# EAGLE design SKAARDUINO_v4.1 (EAGLE 7.5.0)

## Sheet 1 of 2
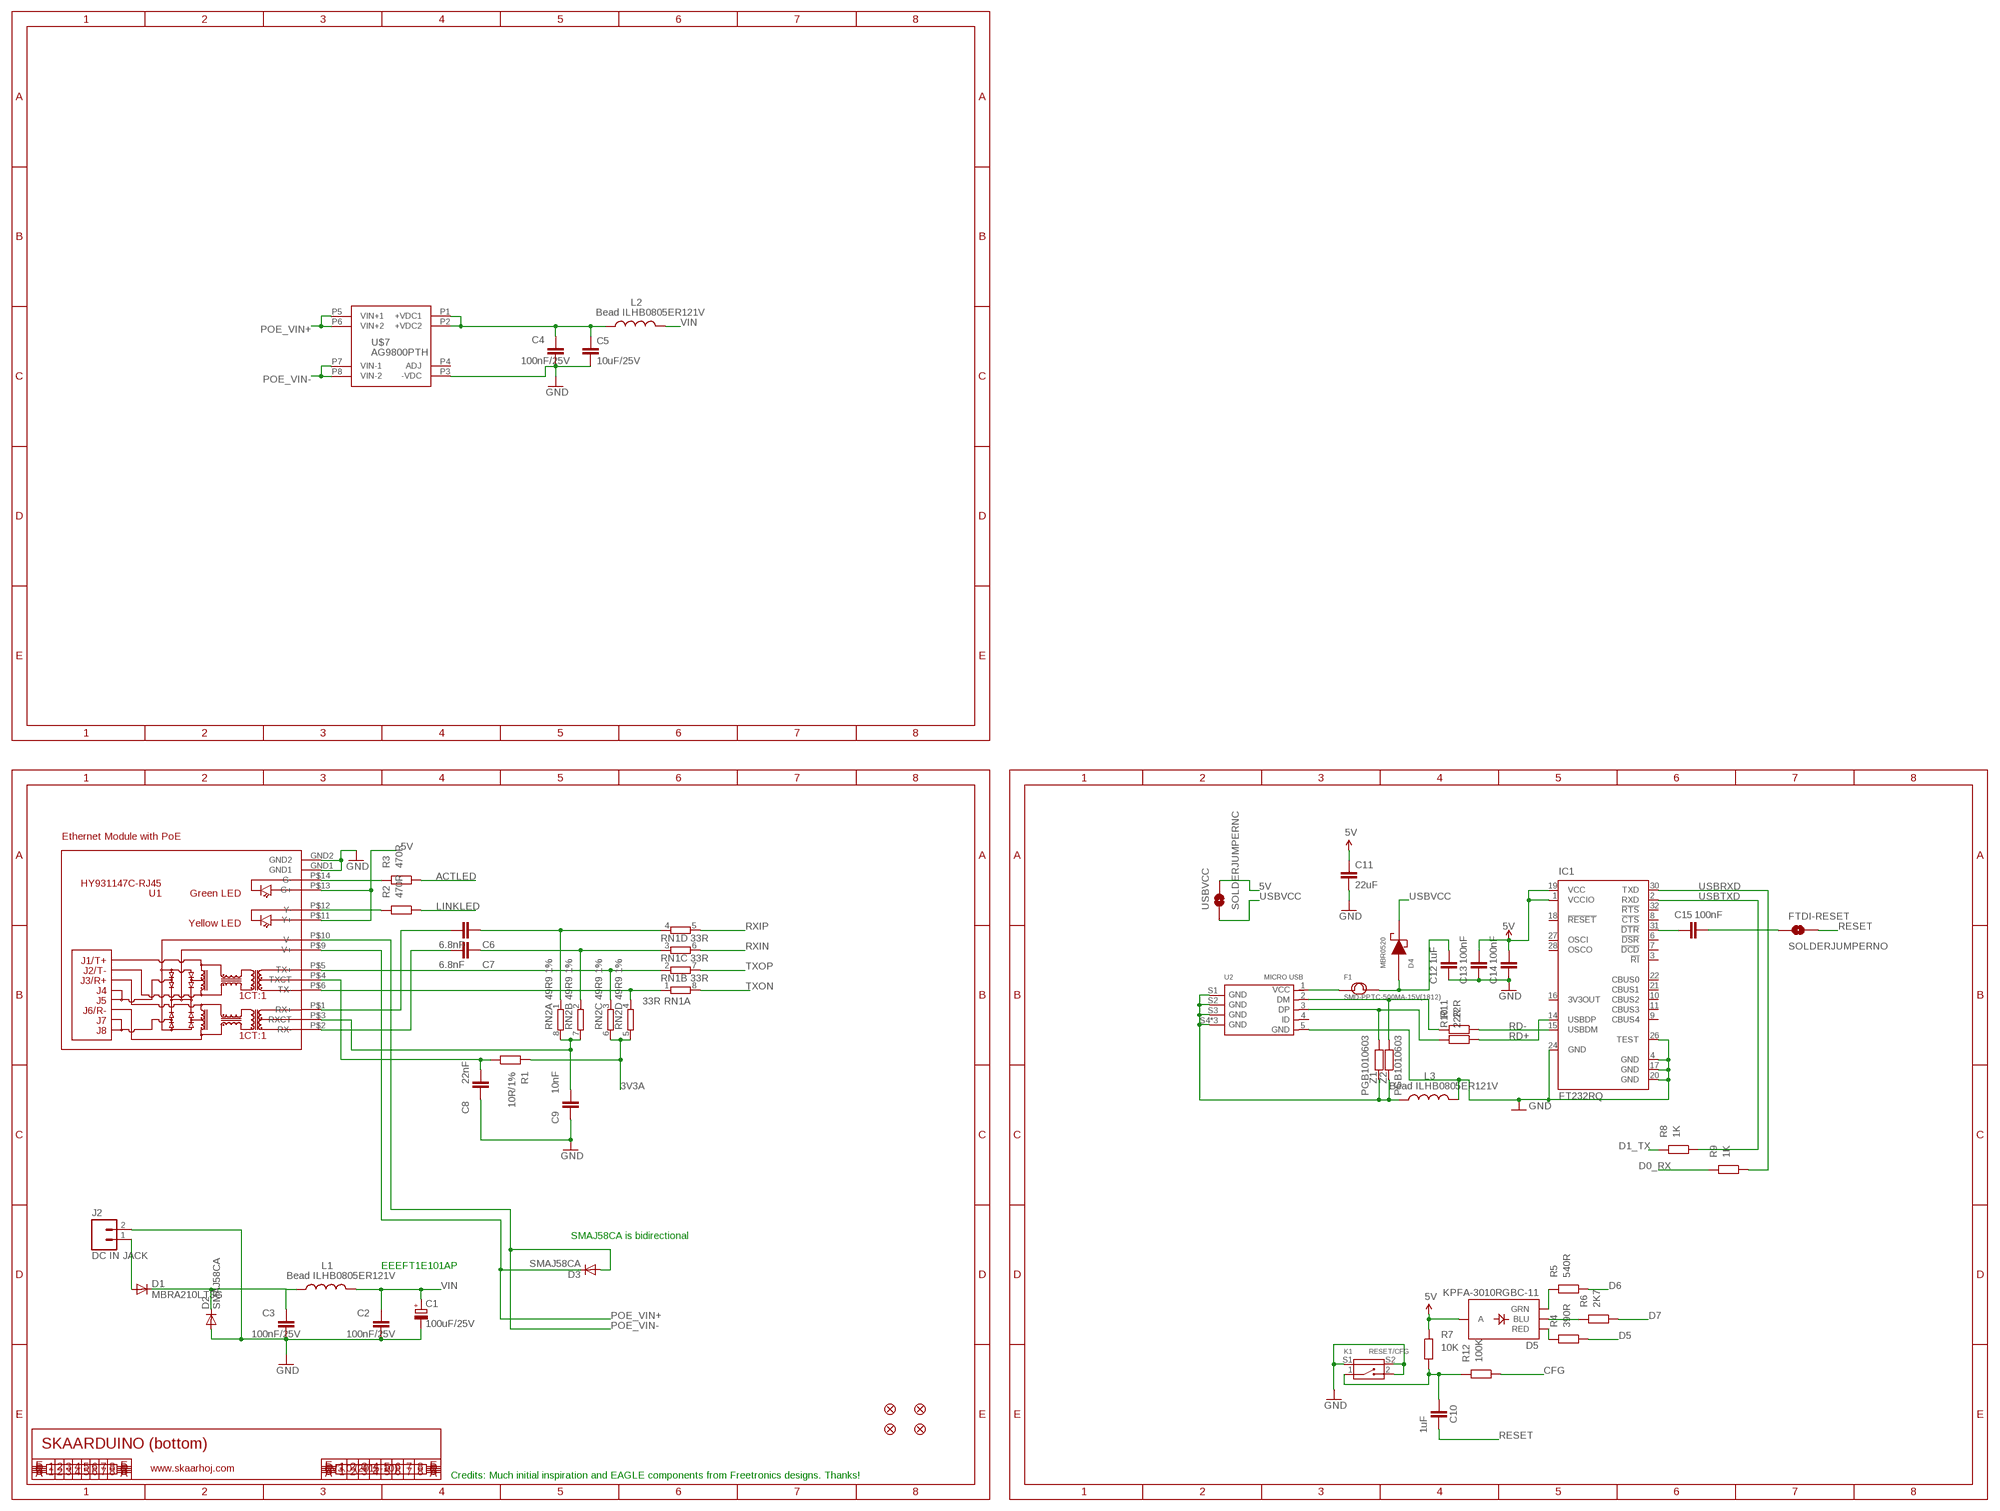
[diagram p0: schematic, sheet 1]

### Parts
C1  100uF/25V  CPOL-EUD  [PANASONIC_D]
C2  100nF/25V  CAP0402  [C0402]
C3  100nF/25V  CAP0402  [C0402]
C4  100nF/25V  CAP0402  [C0402]
C5  10uF/25V  CAP0805  [0805]
C6  6.8nF  C-EU0402C  [0402C]
C7  6.8nF  C-EU0402C  [0402C]
C8  22nF  C-EU0402C  [0402C]
C9  10nF  C-EU0402C  [0402C]
C10  1uF  C-EU0402C  [0402C]
C11  22uF  CAP0805  [0805]
C12  1uF  C-EU0402C  [0402C]
C13  100nF  C-EU0402C  [0402C]
C14  100nF  C-EU0402C  [0402C]
C15  100nF  C-EU0402C  [0402C]
D1  MBRA210LT3G  DIODESMA  [SMA-DIODE]
D2  SMAJ58CA  DIODESMA  [SMA-DIODE]
D3  SMAJ58CA  DIODESMA  [SMA-DIODE]
D4  MBR0520  [SOD-123]
D5  KPFA-3010RGBC-11  LED-TRICOLOR  [LED-TRICOLOR-SMD]
F1  SMD-PPTC-500MA-15V(1812)  [F1812]
FID1  FIDUCIAL1X2.5  [FIDUCIAL-1X2.5]
FID2  FIDUCIAL1X2.5  [FIDUCIAL-1X2.5]
FID3  FIDUCIAL1X2.5  [FIDUCIAL-1X2.5]
FID4  FIDUCIAL1X2.5  [FIDUCIAL-1X2.5]
FTDI-RESET  SOLDERJUMPERNO  [SJ_2S-NO]
IC1  FT232RQ  [QFN32]
J2  DC IN JACK  M02PTH  [1X02]
K1  RESET/CFG  SMD-BUTTON-2+2P  [SW4-SMD-7.0X3.5X3.5MM-90D]
L1  Bead ILHB0805ER121V  L-USL2012C  [L2012C]
L2  Bead ILHB0805ER121V  L-USL2012C  [L2012C]
L3  Bead ILHB0805ER121V  L-USL2012C  [L2012C]
R1  10R/1%  RESISTOR0402  [0402]
R2  470R  RESISTOR0402  [0402]
R3  470R  RESISTOR0402  [0402]
R4  390R  RESISTOR0402  [0402]
R5  540R  RESISTOR0402  [0402]
R6  2K7  RESISTOR0402  [0402]
R7  10K  RESISTOR0402  [0402]
R8  1K  RESISTOR0402  [0402]
R9  1K  RESISTOR0402  [0402]
R10  22R  RESISTOR0402  [0402]
R11  22R  RESISTOR0402  [0402]
R12  100K  RESISTOR0402  [0402]
RN1  33R  4R-NCAY16  [CAY16]
RN2  49R9 1%  4R-NCAY16  [CAY16]
U1  HY931147C-RJ45  [HY931147C]
U2  MICRO USB  MICRO-USB-SMD-B-WITHOUT-POST-W/P(ST-USB-001G)  [MICRO-USB5+4P-SMD-0.65-B]
U$7  AG9800PTH  [AG9800PTH]
USBVCC  SOLDERJUMPERNC  [SJ_2S]
Z1  PGB1010603  RESISTOR0402  [C0402]
Z2  PGB1010603  RESISTOR0402  [C0402]

### Nets
3V3A: R1.2 RN2.5 RN2.6 ; also sheet 2
5V [power]: C11.1 C13.2 C14.2 D5.A IC1.1(VCCIO) IC1.19(VCC) R7.2 U1.P$11(Y+) U1.P$13(G+) USBVCC.2 ; also sheet 2
ACTLED: R3.1 ; also sheet 2
CFG: R12.1 ; also sheet 2
CFGSW: C10.2 K1.1 R7.1 R12.2
D0_RX: R9.2 ; also sheet 2
D1_TX: R8.2 ; also sheet 2
D5: R4.1 ; also sheet 2
D6: R5.1 ; also sheet 2
D7: R6.1 ; also sheet 2
GND [power]: C1.- C2.2 C3.2 C4.2 C5.2 C8.1 C9.1 C11.2 C12.1 C13.1 C14.1 D2.A IC1.4(GND) IC1.17(GND) IC1.20(GND) IC1.24(GND) IC1.26(TEST) J2.2 K1.2 K1.S1 K1.S2 L3.2 U1.GND1 U1.GND2 U2.5(GND) U$7.P3(-VDC) ; also sheet 2
LINKLED: R2.1 ; also sheet 2
N$1: C8.2 R1.1 U1.P$4(TXCT)
N$2: C15.2 FTDI-RESET.1
N$3: D5.B(BLU) R6.2
N$4 [VIN]: C3.1 D1.C D2.C L1.1
N$5: D5.G(GRN) R5.2
N$6 [VIN]: C12.2 D4.2(AN) F1.2
N$7 [VIN]: F1.1 U2.1(VCC)
N$9: C7.2 U1.P$2(RX-)
N$11: C6.2 U1.P$1(RX+)
N$13 [VIN]: D1.A J2.1
N$15: D5.R(RED) R4.2
N$16: R10.2 U2.3(DP) Z1.1
N$17: R11.2 U2.2(DM) Z2.1
N$18: C15.1 IC1.31(!DTR)
N$21: L3.1 U2.S1(GND) U2.S2(GND) U2.S3(GND) U2.S4(GND) U2.S5(GND) U2.S6(GND) Z1.2 Z2.2
N$67: R3.2 U1.P$14(G-)
N$321: C9.2 RN2.7 RN2.8 U1.P$3(RXCT)
N$332: R2.2 U1.P$12(Y-)
POE_DC_RETURN [VIN]: C4.1 C5.1 L2.1 U$7.P1(+VDC1) U$7.P2(+VDC2)
POE_VIN+ [VIN]: D3.C U1.P$9(V+) U$7.P5(VIN+1) U$7.P6(VIN+2)
POE_VIN- [VIN]: D3.A U1.P$10(V-) U$7.P7(VIN-1) U$7.P8(VIN-2)
RD+: IC1.14(USBDP) R10.1
RD-: IC1.15(USBDM) R11.1
RESET: C10.1 FTDI-RESET.2 ; also sheet 2
RXIN: RN1.6 ; also sheet 2
RXIN_E: C7.1 RN1.3 RN2.2
RXIP: RN1.5 ; also sheet 2
RXIP_E: C6.1 RN1.4 RN2.1
TXON: RN1.8 ; also sheet 2
TXON_E: RN1.1 RN2.4 U1.P$6(TX-)
TXOP: RN1.7 ; also sheet 2
TXOP_E: RN1.2 RN2.3 U1.P$5(TX+)
USBRXD: IC1.30(TXD) R9.1
USBTXD: IC1.2(RXD) R8.1
USBVCC [VIN]: D4.1(CA) USBVCC.1
VIN [VIN]: C1.+ C2.1 L1.2 L2.2 ; also sheet 2
Unconnected: IC1.3(!RI) IC1.6(!DSR) IC1.7(!DCD) IC1.8(!CTS) IC1.9(CBUS4) IC1.10(CBUS2) IC1.11(CBUS3) IC1.16(3V3OUT) IC1.18(!RESET) IC1.21(CBUS1) IC1.22(CBUS0) IC1.27(OSCI) IC1.28(OSCO) IC1.32(!RTS) U2.4(ID) U$7.P4(ADJ)

### Notes on the sheet
- Ethernet Module with PoE
- SMAJ58CA is bidirectional
- EEEFT1E101AP
- SKAARDUINO (bottom)
- www.skaarhoj.com | V3.0 (2015-10)
- Credits: Much initial inspiration and EAGLE components from Freetronics designs. Thanks!

## Sheet 2 of 2
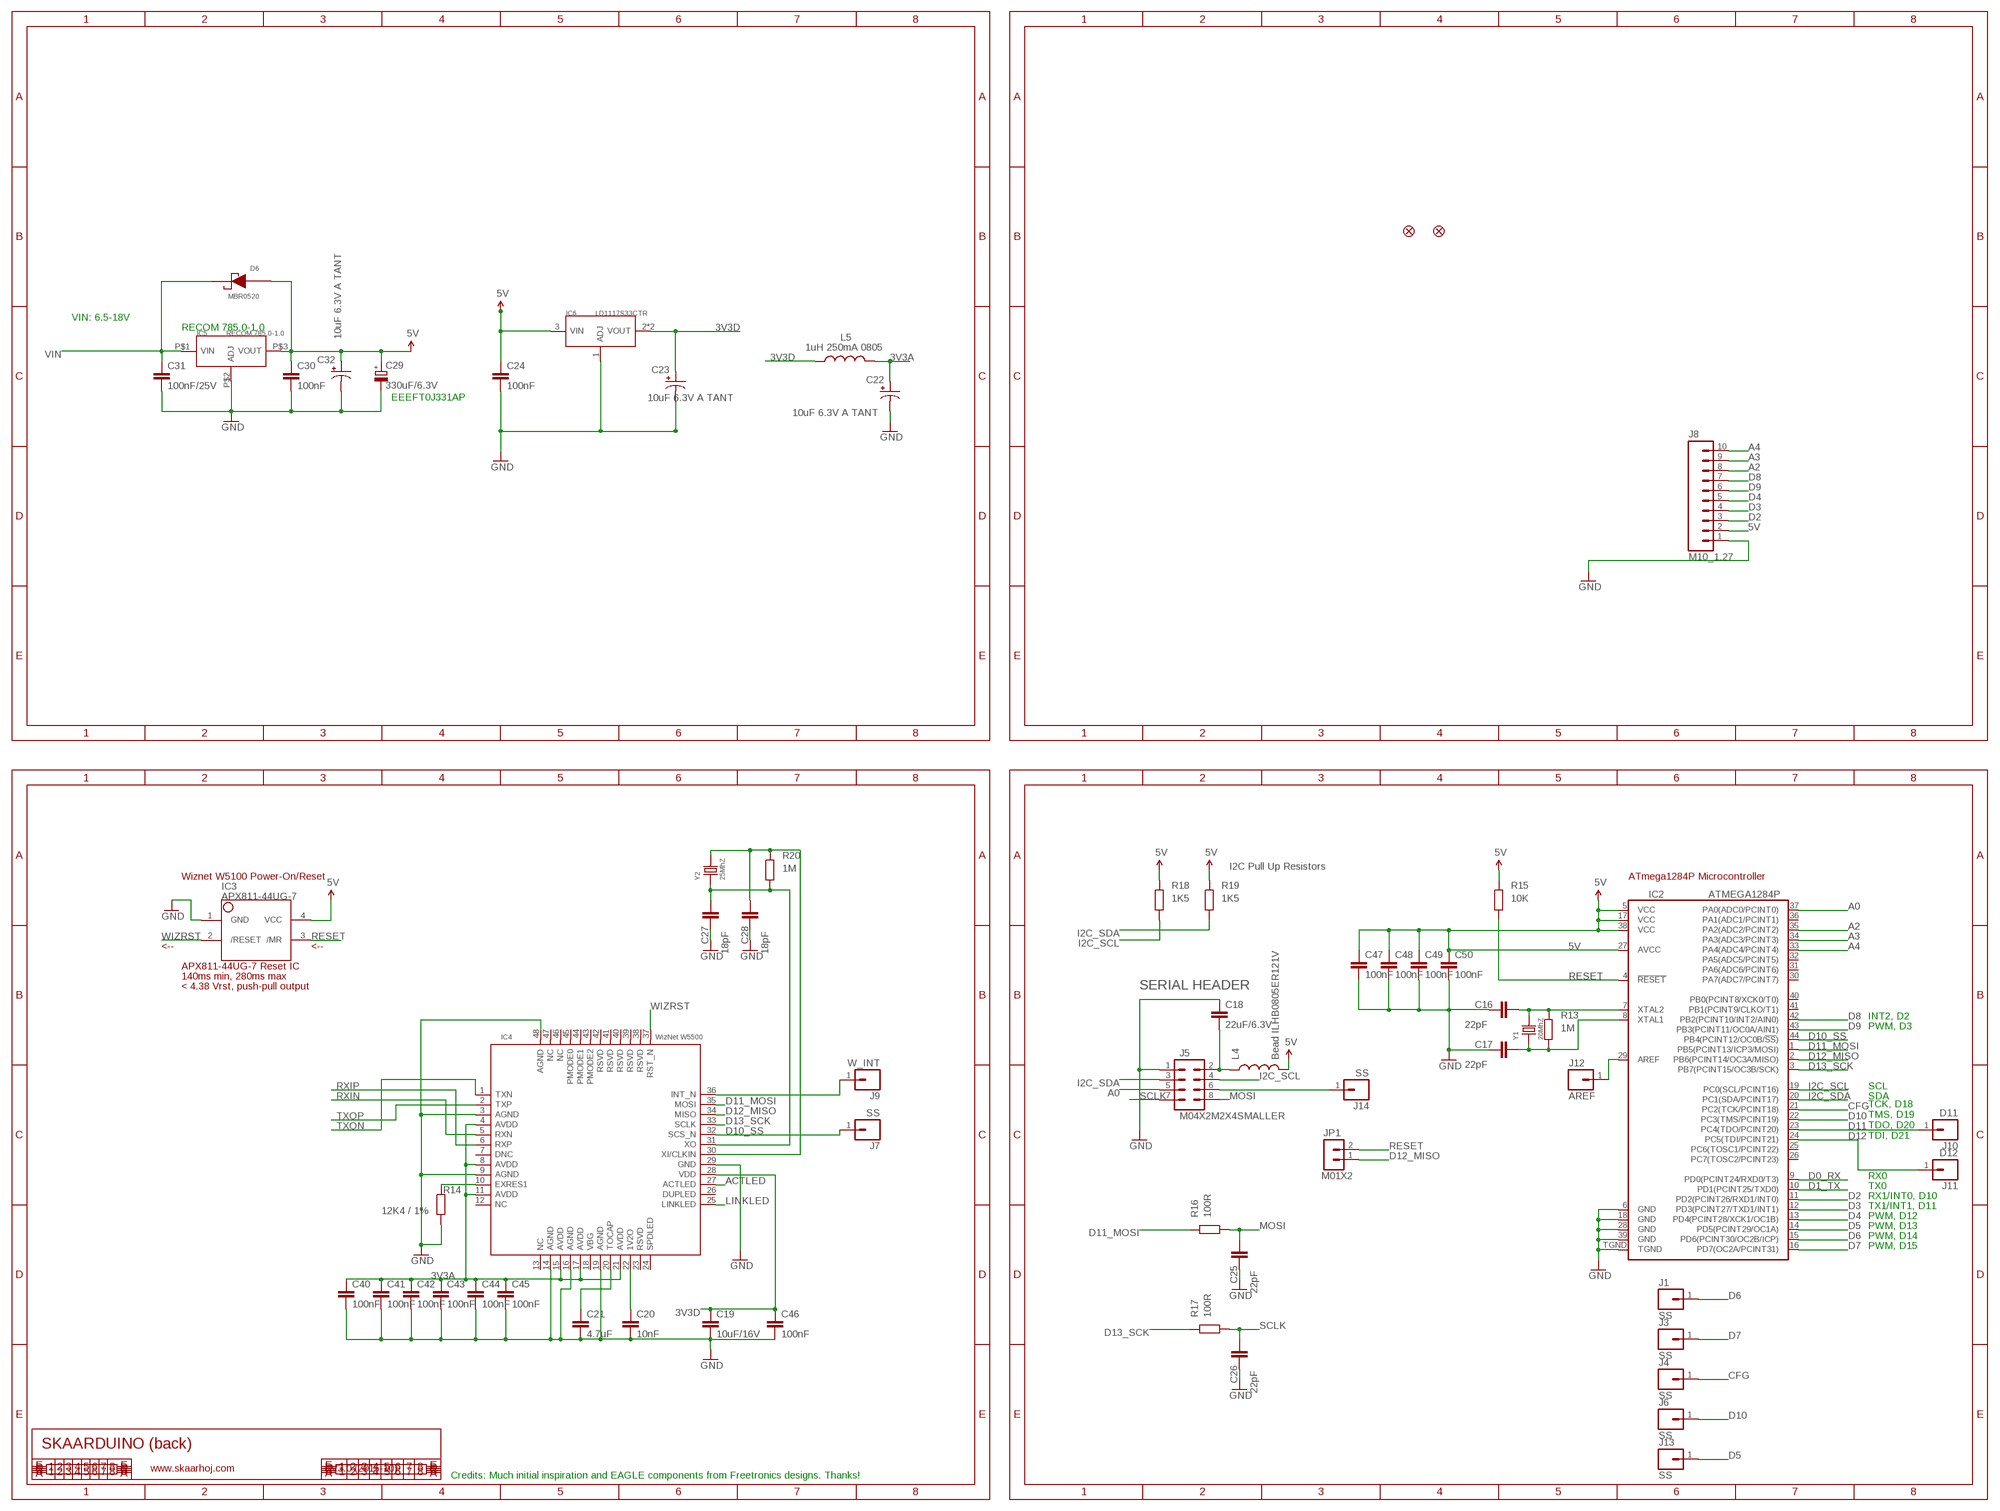
[diagram p1: schematic, sheet 2]

### Parts
C16  22pF  C-EU0402C  [0402C]
C17  22pF  C-EU0402C  [0402C]
C18  22uF/6.3V  CAP0805  [0805]
C19  10uF/16V  CAP0805  [0805]
C20  10nF  C-EU0402C  [0402C]
C21  4.7uF  CAP0805  [0805]
C22  10uF 6.3V A TANT  CAP_POL1206  [EIA3216]
C23  10uF 6.3V A TANT  CAP_POL1206  [EIA3216]
C24  100nF  C-EU0402C  [0402C]
C25  22pF  C-EU0402C  [0402C]
C26  22pF  C-EU0402C  [0402C]
C27  18pF  C-EU0402C  [0402C]
C28  18pF  C-EU0402C  [0402C]
C29  330uF/6.3V  CPOL-EUD  [PANASONIC_D]
C30  100nF  C-EU0402C  [0402C]
C31  100nF/25V  C-EU0402C  [0402C]
C32  10uF 6.3V A TANT  CAP_POL1206  [EIA3216]
C40  100nF  C-EU0402C  [0402C]
C41  100nF  C-EU0402C  [0402C]
C42  100nF  C-EU0402C  [0402C]
C43  100nF  C-EU0402C  [0402C]
C44  100nF  C-EU0402C  [0402C]
C45  100nF  C-EU0402C  [0402C]
C46  100nF  C-EU0402C  [0402C]
C47  100nF  C-EU0402C  [0402C]
C48  100nF  C-EU0402C  [0402C]
C49  100nF  C-EU0402C  [0402C]
C50  100nF  C-EU0402C  [0402C]
D6  MBR0520  [SOD-123]
FID5  FIDUCIAL1X2.5  [FIDUCIAL-1X2.5]
FID8  FIDUCIAL1X2.5  [FIDUCIAL-1X2.5]
IC2  ATMEGA1284P  [QFN-44M1]
IC3  APX811-44UG-7  APX81X-RESET-IC  [SOT143-R]
IC4  WizNet W5500  DRIVER-W5500  [LQFP-48]
IC5  RECOM 785.0-1.0  PMIC-LM317EMP  [RECOM_785.0-1.0]
IC6  LD1117S33CTR  PMIC-LM317EMP-310030006  [SOT-223]
J1  SS  M1X1TEST  [M1X1]
J3  SS  M1X1TEST  [M1X1]
J4  SS  M1X1TEST  [M1X1]
J5  M04X2M2X4SMALLER  [M2X4SMALLER]
J6  SS  M1X1TEST  [M1X1]
J7  SS  M1X1TEST  [M1X1]
J8  M10_1.27  [M10X1]
J9  W_INT  M1X1TEST  [M1X1]
J10  D11  M1X1TEST  [M1X1]
J11  D12  M1X1TEST  [M1X1]
J12  AREF  M1X1TEST  [M1X1]
J13  SS  M1X1TEST  [M1X1]
J14  SS  M1X1TEST  [M1X1]
JP1  M01X2  [M2X1SMALLER]
L4  Bead ILHB0805ER121V  INDUCTOR0805  [0805]
L5  1uH 250mA 0805  L-USL2012C  [L2012C]
R13  1M  RESISTOR0402  [0402]
R14  12K4 / 1%  RESISTOR0402  [0402]
R15  10K  RESISTOR0402  [0402]
R16  100R  RESISTOR0402  [0402]
R17  100R  RESISTOR0402  [0402]
R18  1K5  RESISTOR0402  [0402]
R19  1K5  RESISTOR0402  [0402]
R20  1M  RESISTOR0402  [0402]
Y1  20MhZ  SMD-CRYSTAL-16MHZ-8PF-20PPM-40R(2P-5.0X3.2MM)  [X2-SMD-5.0X3.2X1.3MM]
Y2  25MhZ  SMD-CRYSTAL-16MHZ-8PF-20PPM-40R(2P-5.0X3.2MM)  [X2-SMD-5.0X3.2X1.3MM]

### Nets
3V3A: C22.A(+) C40.1 C41.1 C42.1 C43.1 C44.1 C45.1 IC4.4(AVDD) IC4.8(AVDD) IC4.11(AVDD) IC4.15(AVDD) IC4.17(AVDD) IC4.21(AVDD) L5.2 ; also sheet 1
3V3D [power]: C19.1 C23.A(+) C46.1 IC4.28(VDD) IC6.2(VOUT) IC6.TER(VOUT) L5.1
5V [power]: C24.1 C29.+ C30.1 C32.A(+) C47.1 C48.1 C49.1 C50.1 D6.2(AN) IC2.5(VCC) IC2.17(VCC) IC2.27(AVCC) IC2.38(VCC) IC3.4(VCC) IC5.P$3(VOUT) IC6.3(VIN) J8.2 L4.2 R15.2 R18.2 R19.2 ; also sheet 1
A0: IC2.37(PA0(ADC0/PCINT0)) J5.5
A2: IC2.35(PA2(ADC2/PCINT2)) J8.8
A3: IC2.34(PA3(ADC3/PCINT3)) J8.9
A4: IC2.33(PA4(ADC4/PCINT4)) J8.10
ACTLED: IC4.27(ACTLED) ; also sheet 1
CFG: IC2.21(PC2(TCK/PCINT18)) J4.1 ; also sheet 1
D0_RX: IC2.9(PD0(PCINT24/RXD0/T3)) ; also sheet 1
D1_TX: IC2.10(PD1(PCINT25/TXD0)) ; also sheet 1
D2: IC2.11(PD2(PCINT26/RXD1/INT0)) J8.3
D3: IC2.12(PD3(PCINT27/TXD1/INT1)) J8.4
D4: IC2.13(PD4(PCINT28/XCK1/OC1B)) J8.5
D5: IC2.14(PD5(PCINT29/OC1A)) J13.1 ; also sheet 1
D6: IC2.15(PD6(PCINT30/OC2B/ICP)) J1.1 ; also sheet 1
D7: IC2.16(PD7(OC2A/PCINT31)) J3.1 ; also sheet 1
D8: IC2.42(PB2(PCINT10/INT2/AIN0)) J8.7
D9: IC2.43(PB3(PCINT11/OC0A/AIN1)) J8.6
D10: IC2.22(PC3(TMS/PCINT19)) J6.1
D10_SS: IC2.44(PB4(PCINT12/OC0B/!SS!)) IC4.32(SCS_N) J7.1
D11: IC2.23(PC4(TDO/PCINT20)) J10.1
D11_MOSI: IC2.1(PB5(PCINT13/ICP3/MOSI)) IC4.35(MOSI) R16.2
D12: IC2.24(PC5(TDI/PCINT21)) J11.1
D12_MISO: IC2.2(PB6(PCINT14/OC3A/MISO)) IC4.34(MISO) JP1.1
D13_SCK: IC2.3(PB7(PCINT15/OC3B/SCK)) IC4.33(SCLK) R17.2
GND [power]: C16.1 C17.1 C18.1 C19.2 C20.2 C21.2 C22.C(-) C23.C(-) C24.2 C25.1 C26.1 C27.1 C28.1 C29.- C30.2 C31.2 C32.C(-) C40.2 C41.2 C42.2 C43.2 C44.2 C45.2 C46.2 C47.2 C48.2 C49.2 C50.2 IC2.6(GND) IC2.18(GND) IC2.28(GND) IC2.39(GND) IC2.TGND IC3.1(GND) IC4.3(AGND) IC4.9(AGND) IC4.14(AGND) IC4.16(AGND) IC4.19(AGND) IC4.29(GND) IC4.48(AGND) IC5.P$2(ADJ) IC6.1(ADJ) J5.1 J8.1 R14.1 ; also sheet 1
I2C_SCL: IC2.19(PC0(SCL/PCINT16)) J5.4 R18.1
I2C_SDA: IC2.20(PC1(SDA/PCINT17)) J5.3 R19.1
LINKLED: IC4.25(LINKLED) ; also sheet 1
MOSI: C25.2 J5.8 R16.1
N$8: C16.2 IC2.7(XTAL2) R13.2 Y1.2
N$10: J5.6 J14.1
N$12: C17.2 IC2.8(XTAL1) R13.1 Y1.1
N$19 [power]: C18.2 J5.2 L4.1
N$20: C21.1 IC4.20(TOCAP)
N$22: C20.1 IC4.22(1V2O)
N$23: IC4.10(EXRES1) R14.2
N$24: IC4.36(INT_N) J9.1
N$25: IC2.29(AREF) J12.1
RESET: IC2.4(!RESET) IC3.3(/MR) JP1.2 R15.1 ; also sheet 1
RXIN: IC4.5(RXN) ; also sheet 1
RXIP: IC4.6(RXP) ; also sheet 1
SCLK: C26.2 J5.7 R17.1
TXON: IC4.1(TXN) ; also sheet 1
TXOP: IC4.2(TXP) ; also sheet 1
VIN [VIN]: C31.1 D6.1(CA) IC5.P$1(VIN) ; also sheet 1
WIZRST: IC3.2(/RESET) IC4.37(RST_N)
XTLN: C28.2 IC4.30(XI/CLKIN) R20.2 Y2.2
XTLP: C27.2 IC4.31(XO) R20.1 Y2.1
Unconnected: IC2.25(PC6(TOSC1/PCINT22)) IC2.26(PC7(TOSC2/PCINT23)) IC2.30(PA7(ADC7/PCINT7)) IC2.31(PA6(ADC6/PCINT6)) IC2.32(PA5(ADC5/PCINT5)) IC2.36(PA1(ADC1/PCINT1)) IC2.40(PB0(PCINT8/XCK0/T0)) IC2.41(PB1(PCINT9/CLKO/T1)) IC4.7(DNC) IC4.12(NC) IC4.13(NC) IC4.18(VBG) IC4.23(RSVD) IC4.24(SPDLED) IC4.26(DUPLED) IC4.38(RSVD) IC4.39(RSVD) IC4.40(RSVD) IC4.41(RSVD) IC4.42(RSVD) IC4.43(PMODE2) IC4.44(PMODE1) IC4.45(PMODE0) IC4.46(NC) IC4.47(NC)

### Notes on the sheet
- VIN: 6.5-18V
- RECOM 785.0-1.0
- EEEFT0J331AP
- I2C Pull Up Resistors
- Wiznet W5100 Power-On/Reset | ATmega1284P Microcontroller
- <-- | <--
- APX811-44UG-7 Reset IC
- 140ms min, 280ms max
- < 4.38 Vrst, push-pull output | SERIAL HEADER
- INT2, D2
- PWM, D3
- SCL
- SDA
- TCK, D18
  TMS, D19
  TDO, D20
  TDI, D21
- RX0
- TX0
- RX1/INT0, D10
- TX1/INT1, D11
- PWM, D12
- PWM, D13
- PWM, D14
- PWM, D15
- SKAARDUINO (back)
- www.skaarhoj.com | V3.0 (2015-10)
- Credits: Much initial inspiration and EAGLE components from Freetronics designs. Thanks!

## Library data of the parts
C1 C29 = rcl:CPOL-EU: POLARIZED CAPACITOR, European symbol
C2-C4 = freetronics:CAP: Capacitor Standard 0603 ceramic capacitor, and 0.1" leaded capacitor.
C5 C11 C18 C19 C21 = SparkFun:CAP: Capacitor Standard 0603 ceramic capacitor, and 0.1" leaded capacitor.
C6-C10 C12-C17 C20 C24-C28 C30 C31 C40-C50 = freetronics-jon:C-EU: CAPACITOR, European symbol
C22 C23 C32 = freetronics:CAP_POL: Capacitor Polarized These are standard SMD and PTH capacitors. Normally 10uF, 47uF, and 100uF in electrolytic and tantalum varieties. Always verify the external diameter of the through hole cap, it varies with capacity, voltage, and manufacturer. The EIA devices should be standard.
D1-D3 = SparkFun:DIODE: Diode These are standard reverse protection diodes and small signal diodes. SMA package can handle up to about 1A. SOD-323 can handle about 200mA. What the SOD-323 package when ordering, there are some mfgs out there that are 5-pin packages.
D4 D6 = MySMD:MBR0520
D5 = SKAARHOJ:LED-TRICOLOR: Tri-Color LED SMD Proven layout and schematic for triple color LED in SMD package - common anode. Spark Fun Electronics SKU : COM-07844
F1 = Seeed-OPL-fuse:SMD-PPTC-500MA-15V(1812): 307010007
FID1-FID5 FID8 = freetronics:FIDUCIAL: Fiducial Alignment Points Various fiducial points for machine vision alignment.
FTDI-RESET USBVCC = SparkFun:SOLDERJUMPER: Solder Jumper Standard SMD solder jumper. Used to automate production. Two varients : Normally Open and Normally Closed are the same, but have different paste layers. NC will have a large amount of paste and should jumper during reflow.
IC1 = ftdichip:FT232R: Source: http://www.ftdichip.com/Documents/DataSheets/DS_FT232R_v104.pdf; MPN: FT232RQ; OC_FARNELL: 1146033; OC_NEWARK: 91K9919
IC2 = freetronics-jon:ATMEGA1284P
IC3 = freetronics-master-v1:APX81X-RESET-IC
IC4 = template:DRIVER-W5500
IC5 IC6 = SKAARHOJ:PMIC-LM317EMP: 3-Terminal Adjustable Regulator
J1 J3 J4 J6 J7 J9-J14 = SKAARHOJ:M1X1
J2 = SparkFun:M02: Header 2 Standard 2-pin 0.1" header. Use with straight break away headers (SKU : PRT-00116), right angle break away headers (PRT-00553), swiss pins (PRT-00743), machine pins (PRT-00117), and female headers (PRT-00115). Molex polarized connector foot print use with SKU : PRT-08233 with associated crimp pins and housings.
J5 = SKAARHOJ:M04X2
J8 = SKAARHOJ:M10_1.27
JP1 = SKAARHOJ:M01X2
K1 = Seeed-OPL-Button:SMD-BUTTON-2+2P: 311020023; MPN: TS-1188E
L1-L3 L5 = rcl:L-US: INDUCTOR, American symbol
L4 = SparkFun:INDUCTOR: Inductors Basic Inductor/Choke - 0603 and 1206. Footprints are not proven and vary greatly between part numbers.
R1-R20 = freetronics-jon:RESISTOR: Resistor Basic schematic elements and footprints for 0603, 1206, and PTH 1/10th watt (small) resistors.
RN1 RN2 = freetronics-master-v1:4R-N: Array Chip Resistor Source: RS Component / Phycomp
U1 = freetronics-jon:HY931147C
U2 = Seeed-OPL-Connector:MICRO-USB-SMD-B-WITHOUT-POST-W/P(ST-USB-001G): 320010000; MPN: ST-USB-001G
U$7 = SKAARHOJ:AG9800
Y1 Y2 = Seeed-OPL-crystal-osctllator:SMD-CRYSTAL-16MHZ-8PF-20PPM-40R(2P-5.0X3.2MM): 306010054; MPN: X053201602002
Z1 Z2 = freetronics:RESISTOR: Resistor Basic schematic elements and footprints for 0603, 1206, and PTH 1/10th watt (small) resistors.

## Net classes
0 default: width 0.203 mm, clearance 0.127 mm
1 power: width 0.203 mm, clearance 0.127 mm
2 VIN: width 0.406 mm, clearance 0.61 mm

## Board
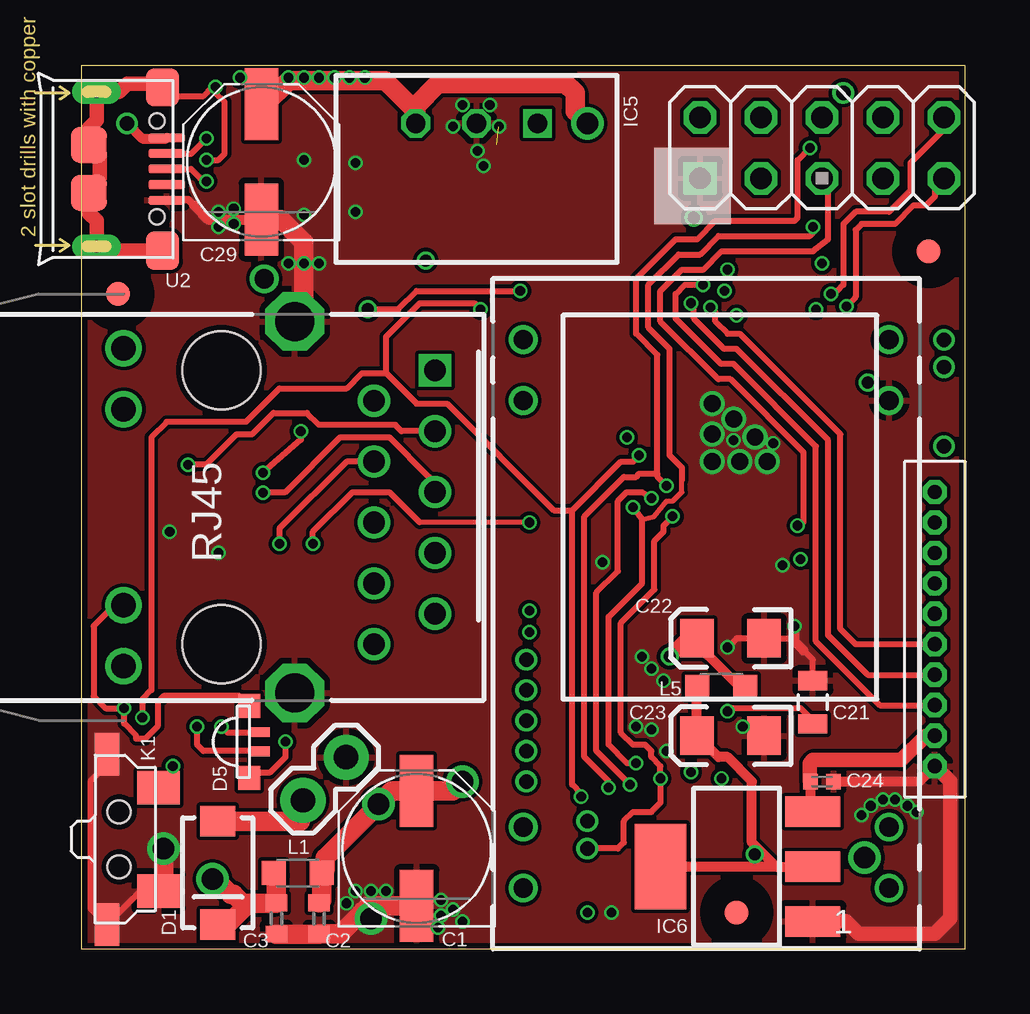
[diagram p2: board, top side]
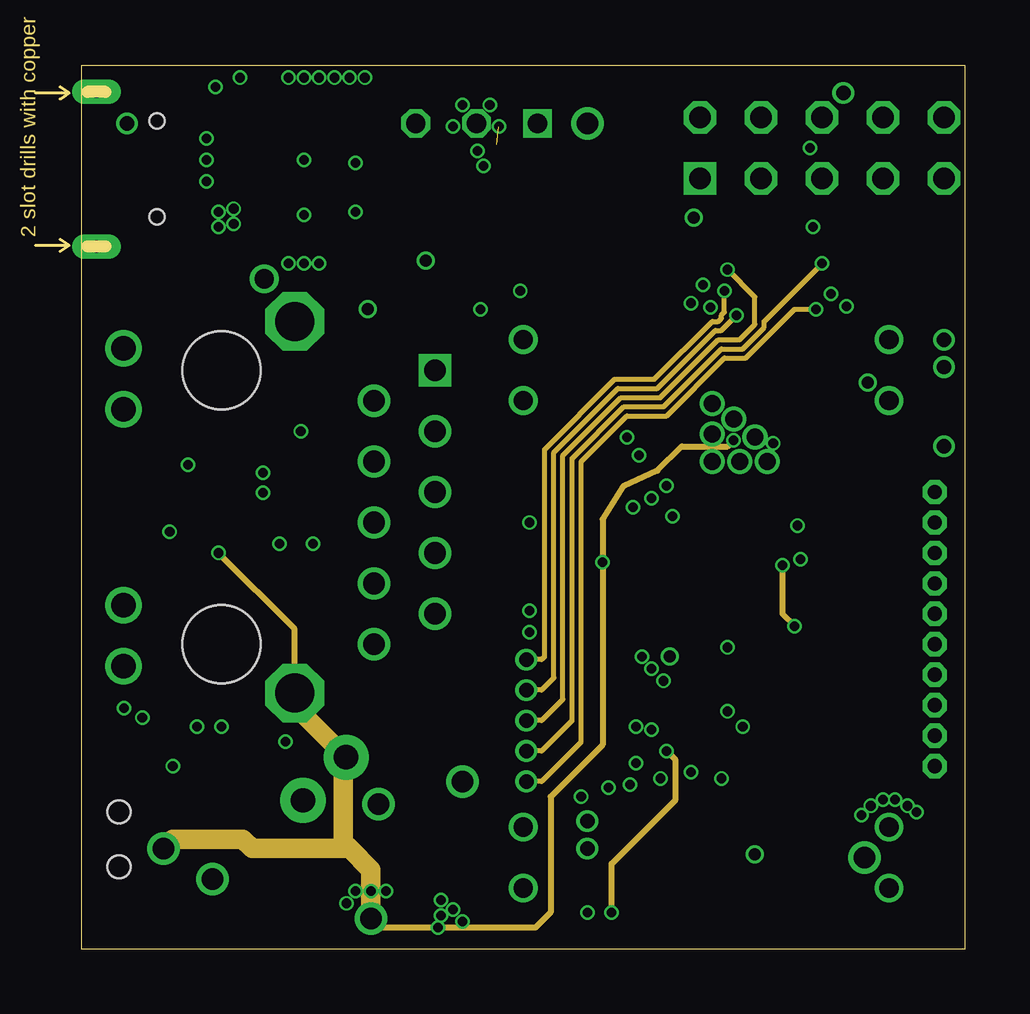
[diagram p3: board, inner layer GND]
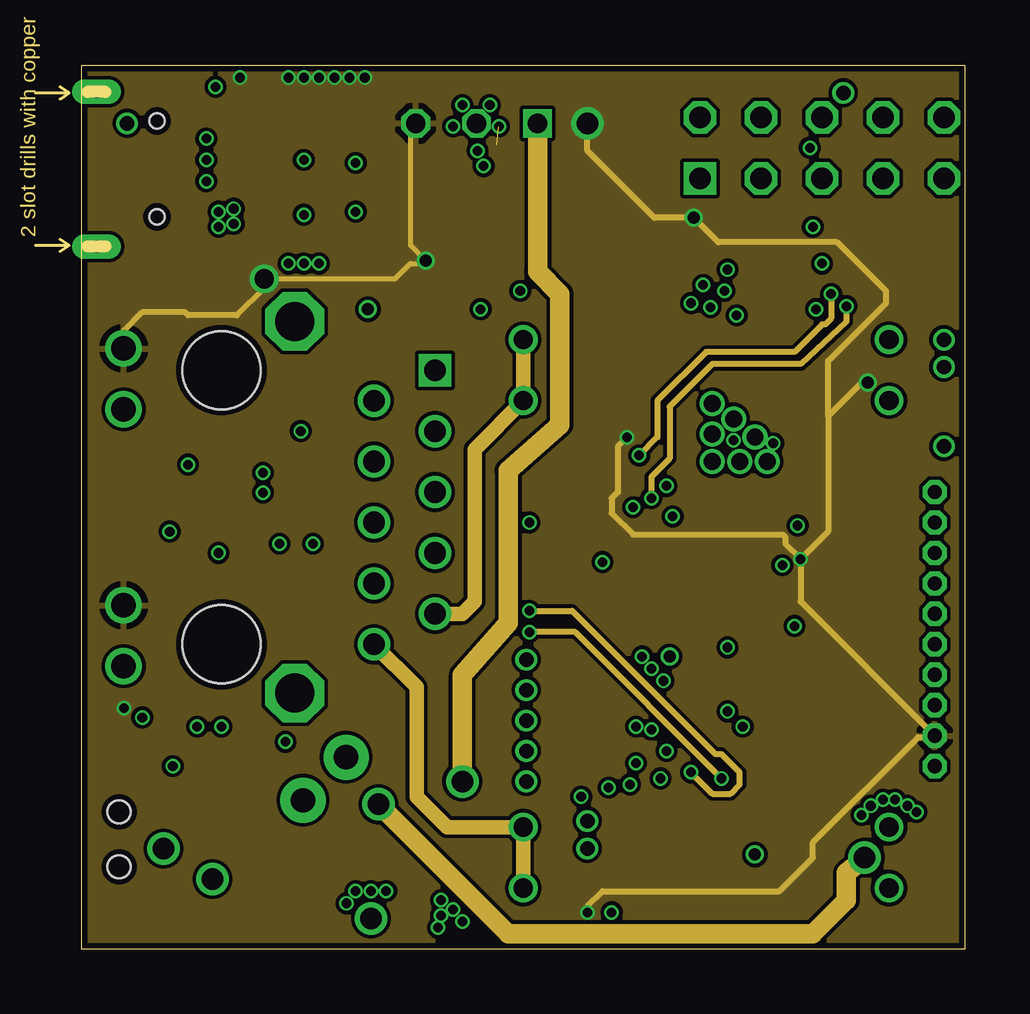
[diagram p4: board, inner layer 5V]
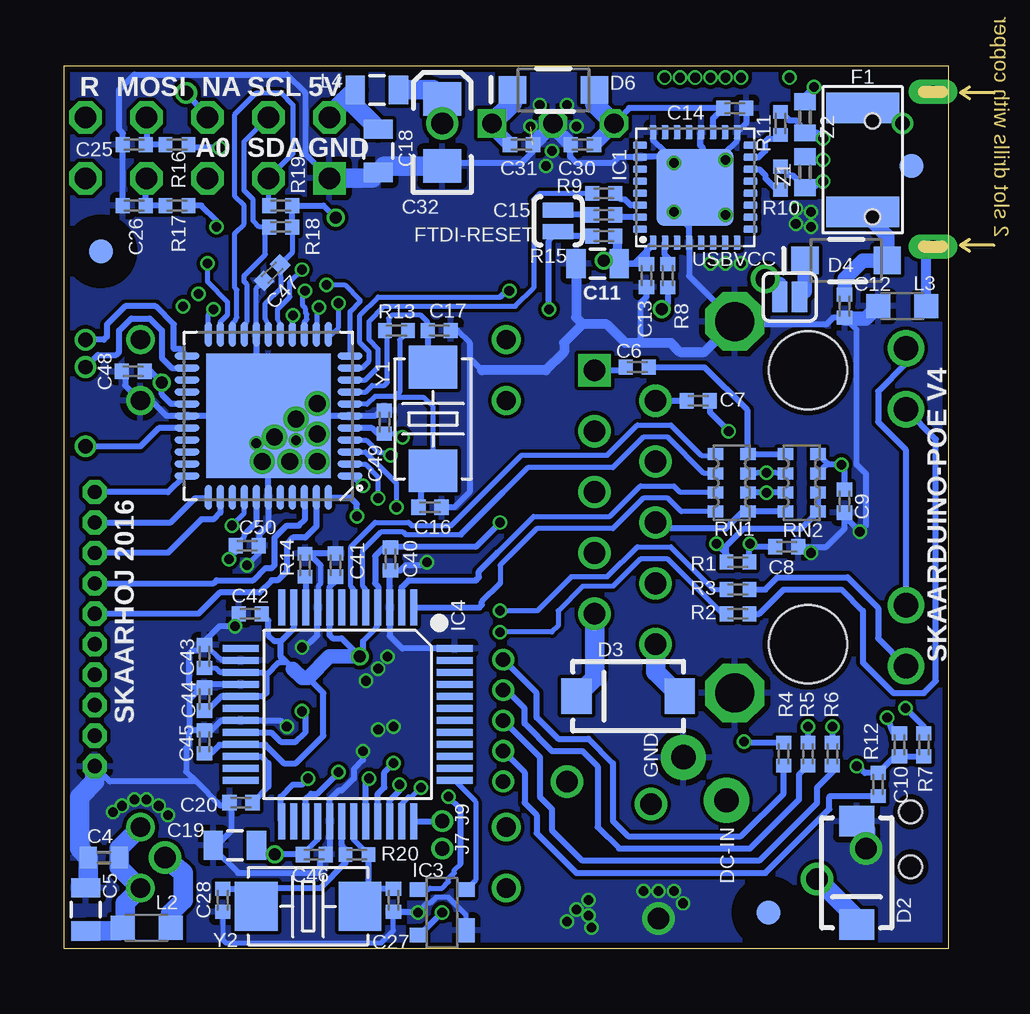
[diagram p5: board, bottom side, seen from below]

Size 36.83 x 36.83 mm. Coordinates in mm from the lower left corner, seen from the top.
Outline: 0,0 36.83,0 36.83,36.83 0,36.83 0,0
Copper layers (1*2*15*16): Top 0.035mm / dielectric 0.2mm / GND 0.0175mm / dielectric 0.3mm / 5V 0.0175mm / dielectric 0.2mm / Bottom 0.035mm
Design rules "SeeedStudio_4layer_DRU_no_angle_20140221 *": minimum track width 8mil, minimum drill 12mil, track to track 6mil, track to pad 6mil, pad to pad 6mil, via to via 6mil, smd to smd 0mil, copper to edge 10mil, drill to drill 8mil, minimum pad ring 6mil, minimum via ring 4mil, stop-mask expansion 4mil, vias tented up to drill 100mil, thermal gap 10mil
tKeepout: area 19.7,0 to 23,36.8
tRestrict: area 0.5,26.3 to 2.5,28.3; area 34.3,28.1 to 36.3,30.1; area 26.3,0.5 to 28.3,2.5
bRestrict: area 6.5,0.5 to 8.5,2.5; area 0.5,31.6 to 2.5,33.7; area 34.3,28.1 to 36.3,30.1

### Footprints (pad centres in the part's own frame; a part is rotated, then mirrored left to right if it is on the bottom)
PANASONIC_D = smd 3 x 1.4: + 2.4,0; - -2.4,0
C0402 = smd 0.7 x 0.9: 1 -0.65,0; 2 0.65,0
0805 = smd 0.8 x 1.2: 1 -0.9,0; 2 0.9,0
0402C = smd 0.59 x 0.64: 1 -0.48,0; 2 0.48,0
EIA3216 = smd 1.4 x 1.6: A 1.4,0; C -1.4,0
SMA-DIODE = smd 1.27 x 1.47: A -2.15,0; C 2.15,0
SOD-123 = smd 1.143 x 1.143: 1 0,0; 2 3.429,0
LED-TRICOLOR-SMD = smd 1 x 0.9: A -1.5,0; R 1.5,0 | smd 0.4 x 0.8: B 0.4,0.45; G -0.4,0.45
F1812 = smd 1.27 x 3.048: 1 -2.159,0; 2 2.159,0
FIDUCIAL-1X2.5 = smd 1 x 1: 1 0,0
SJ_2S-NO = smd 0.635 x 1.27: 1 -0.45,0; 2 0.45,0
QFN32 = smd 0.6 x 0.3: 1 -2.3,1.75; 2 -2.3,1.25; 3 -2.3,0.75; 4 -2.3,0.25; 5 -2.3,-0.25; 6 -2.3,-0.75; 7 -2.3,-1.25; 8 -2.3,-1.75; 17 2.3,-1.75; 18 2.3,-1.25; 19 2.3,-0.75; 20 2.3,-0.25; 21 2.3,0.25; 22 2.3,0.75; 23 2.3,1.25; 24 2.3,1.75 | smd 0.3 x 0.6: 9 -1.75,-2.3; 10 -1.25,-2.3; 11 -0.75,-2.3; 12 -0.25,-2.3; 13 0.25,-2.3; 14 0.75,-2.3; 15 1.25,-2.3; 16 1.75,-2.3; 25 1.75,2.3; 26 1.25,2.3; 27 0.75,2.3; 28 0.25,2.3; 29 -0.25,2.3; 30 -0.75,2.3; 31 -1.25,2.3; 32 -1.75,2.3 | smd 3.2 x 3.2: EXP 0,0
QFN-44M1 = smd 0.3 x 1.05: 1 -2.5,-3.4; 2 -2,-3.4; 3 -1.5,-3.4; 4 -1,-3.4; 5 -0.5,-3.4; 6 0,-3.4; 7 0.5,-3.4; 8 1,-3.4; 9 1.5,-3.4; 10 2,-3.4; 11 2.5,-3.4; 23 2.5,3.4; 24 2,3.4; 25 1.5,3.4; 26 1,3.4; 27 0.5,3.4; 28 0,3.4; 29 -0.5,3.4; 30 -1,3.4; 31 -1.5,3.4; 32 -2,3.4; 33 -2.5,3.4 | smd 1.05 x 0.3: 12 3.4,-2.5; 13 3.4,-2; 14 3.4,-1.5; 15 3.4,-1; 16 3.4,-0.5; 17 3.4,0; 18 3.4,0.5; 19 3.4,1; 20 3.4,1.5; 21 3.4,2; 22 3.4,2.5; 34 -3.4,2.5; 35 -3.4,2; 36 -3.4,1.5; 37 -3.4,1; 38 -3.4,0.5; 39 -3.4,0; 40 -3.4,-0.5; 41 -3.4,-1; 42 -3.4,-1.5; 43 -3.4,-2; 44 -3.4,-2.5 | smd 5.2 x 5.2: TGND 0,0
SOT143-R = smd 1 x 0.7: 1 -0.75,-1 | smd 0.6 x 0.7: 2 0.95,-1; 3 0.95,1; 4 -0.95,1
LQFP-48 = smd 1.5 x 0.3: 1 -4.45,2.75; 2 -4.45,2.25; 3 -4.45,1.75; 4 -4.45,1.25; 5 -4.45,0.75; 6 -4.45,0.25; 7 -4.45,-0.25; 8 -4.45,-0.75; 9 -4.45,-1.25; 10 -4.45,-1.75; 11 -4.45,-2.25; 12 -4.45,-2.75; 25 4.45,-2.75; 26 4.45,-2.25; 27 4.45,-1.75; 28 4.45,-1.25; 29 4.45,-0.75; 30 4.45,-0.25; 31 4.45,0.25; 32 4.45,0.75; 33 4.45,1.25; 34 4.45,1.75; 35 4.45,2.25; 36 4.45,2.75 | smd 0.3 x 1.5: 13 -2.75,-4.45; 14 -2.25,-4.45; 15 -1.75,-4.45; 16 -1.25,-4.45; 17 -0.75,-4.45; 18 -0.25,-4.45; 19 0.25,-4.45; 20 0.75,-4.45; 21 1.25,-4.45; 22 1.75,-4.45; 23 2.25,-4.45; 24 2.75,-4.45; 37 2.75,4.45; 38 2.25,4.45; 39 1.75,4.45; 40 1.25,4.45; 41 0.75,4.45; 42 0.25,4.45; 43 -0.25,4.45; 44 -0.75,4.45; 45 -1.25,4.45; 46 -1.75,4.45; 47 -2.25,4.45; 48 -2.75,4.45
RECOM_785.0-1.0 = drill 0.8 square: P$1 -2.54,0 | drill 0.8 octagon: P$2 0,0; P$3 2.54,0
SOT-223 = smd 1.27 x 2.286: 1 -2.286,-3.175; 2 0,-3.175; 3 2.286,-3.175 | smd 3.556 x 2.159: TER 0,3.175
M1X1 = drill 0.6 pad 0.813: 1 0,0
1X02 = drill 1.016 pad 1.88: 1 0,0; 2 2.54,0
M2X4SMALLER = drill 0.9 square: 1 -1.27,3.81 | drill 0.9 octagon: 2 1.27,3.81; 3 -1.27,1.27; 4 1.27,1.27; 5 -1.27,-1.27; 6 1.27,-1.27; 7 -1.27,-3.81; 8 1.27,-3.81
M10X1 = drill 0.6 pad 1.016 octagon: 1 0,0; 2 0,1.27; 3 0,2.54; 4 0,3.81; 5 0,5.08; 6 0,6.35; 7 0,7.62; 8 0,8.89; 9 0,10.16; 10 0,11.43
M2X1SMALLER = drill 0.9 octagon: 1 0,0; 2 0,2.54
SW4-SMD-7.0X3.5X3.5MM-90D = smd 1.397 x 1.778: 1 -2.159,1.651; 2 2.159,1.651 | smd 1.778 x 1.016: S1 -3.556,-0.508; S2 3.556,-0.508 | hole 0.95: -1.15,0; 1.15,0
L2012C = smd 1 x 1: 1 -1,0; 2 1,0
0402 = smd 0.571 x 0.62: 1 -0.48,0; 2 0.48,0
CAY16 = smd 0.5 x 0.65: 1 -1.2,-0.675; 2 -0.4,-0.675; 3 0.4,-0.675; 4 1.2,-0.675; 5 1.2,0.675; 6 0.4,0.675; 7 -0.4,0.675; 8 -1.2,0.675
HY931147C = drill 1.63 octagon: GND1 3.05,7.745; GND2 3.05,-7.745 | drill 0.9 square: P$1 8.89,5.715 | drill 0.9: P$2 6.35,4.445; P$3 8.89,3.175; P$4 6.35,1.905; P$5 8.89,0.635; P$6 6.35,-0.635; P$7 8.89,-1.905; P$8 6.35,-3.175; P$9 8.89,-4.445; P$10 6.35,-5.715 | drill 1.016: P$11 -4.08,6.625; P$12 -4.08,4.085; P$13 -4.08,-4.085; P$14 -4.08,-6.625 | hole 3.25: 0,5.715; 0,-5.715
MICRO-USB5+4P-SMD-0.65-B = smd 0.381 x 1.524: 1 -1.3,-0.25; 2 -0.65,-0.25; 3 0,-0.25; 4 0.65,-0.25; 5 1.3,-0.25 | smd 1.6 x 1.397: S1 -3.4,-0.427; S6 3.4,-0.427 | drill 0.508 pad 1.016 long: S2 -3.226,-3.175; S5 3.226,-3.175 | smd 1.5 x 1.5: S3 -1,-3.5; S4 1,-3.5 | hole 0.635: -2,-0.65; 2,-0.65
AG9800PTH = drill 0.8: P1 -7.62,11.43; P2 -7.62,8.89; P3 -7.62,-8.89; P4 -7.62,-11.43; P5 7.62,-11.43; P6 7.62,-8.89; P7 7.62,8.89; P8 7.62,11.43
SJ_2S = smd 0.635 x 1.27: 1 -0.412,0; 2 0.412,0
X2-SMD-5.0X3.2X1.3MM = smd 1.778 x 2.032: 1 -2.159,0; 2 2.159,0

### Placement (x,y rotation side)
C1  13.97,4.19 90 top
C2  9.91,1.27 270 top
C3  8.13,1.27 270 top
C4  35.18,3.81 180 bottom
C5  35.94,1.65 90 bottom
C6  12.95,24.26 180 bottom
C7  10.41,22.86 180 bottom
C8  6.73,16.76 180 bottom
C9  4.32,18.67 90 bottom
C10  2.03,8.51 270 bottom
C11  14.61,28.57 180 bottom
C12  4.32,26.8 90 bottom
C13  12.57,28.07 90 bottom
C14  8.89,35.05 180 bottom
C15  14.35,30.61 180 bottom
C16  21.59,18.41 180 bottom
C17  21.21,25.78 180 bottom
C18  23.75,33.27 90 bottom
C19  29.72,4.32 180 bottom
C20  29.46,6.1 180 bottom
C21  30.48,10.29 90 top
C22  27.05,12.95 180 top
C23  27.05,8.89 180 top
C24  30.86,6.99 0 top
C25  33.91,33.53 0 bottom
C26  33.91,30.99 0 bottom
C27  23.11,2.03 90 bottom
C28  30.23,2.03 90 bottom
C29  7.5,32.81 90 top
C30  15.24,33.53 180 bottom
C31  17.78,33.53 0 bottom
C32  21.08,34.04 90 bottom
C40  23.24,16.26 270 bottom
C41  25.53,16 90 bottom
C42  29.08,13.97 180 bottom
C43  30.99,12.19 90 bottom
C44  30.99,10.41 90 bottom
C45  30.99,8.64 90 bottom
C46  26.42,3.94 0 bottom
C47  28.17,28.19 225 bottom
C48  33.96,24.08 180 bottom
C49  23.5,21.97 90 bottom
C50  29.21,16.81 0 bottom
D1  5.68,3.17 270 top
D2  3.81,3.17 270 bottom
D3  13.34,10.54 180 bottom
D4  5.97,28.7 0 bottom
D5  7,8.64 270 top
D6  18.16,35.81 0 bottom
F1  3.56,32.89 270 bottom
FID1  1.52,27.3 0 top
FID2  1.52,32.64 0 bottom
FID3  35.31,29.08 0 top
FID4  7.49,1.52 0 bottom
FID5  27.3,1.52 0 top
FID8  35.31,29.08 0 bottom
FTDI-RESET  16.26,30.35 270 bottom
IC1  10.54,31.75 90 bottom
IC2  28.32,22.23 90 bottom
IC3  21.08,1.52 90 bottom
IC4  25.02,9.78 270 bottom
IC5  16.47,34.42 180 top
IC6  27.3,3.44 90 top
J1  18.54,10.79 0 top
J2  9.24,6.2 45 top
J3  18.54,9.53 0 top
J4  18.54,8.26 0 top
J5  29.59,33.4 90 top
J6  18.54,6.99 0 top
J7  21.08,4.19 0 bottom
J8  35.56,7.62 0 top
J9  21.08,5.33 0 top
J10  35.94,25.4 0 top
J11  35.94,24.26 0 top
J12  35.94,20.95 0 top
J13  18.54,12.06 0 top
J14  31.75,35.69 0 top
JP1  35.94,32.13 0 top
K1  1.57,4.57 270 top
L1  9.02,3.17 0 top
L2  33.4,0.89 0 bottom
L3  1.91,26.8 180 bottom
L4  23.8,35.81 0 bottom
L5  26.67,10.92 0 top
R1  8.76,16.13 180 bottom
R2  8.76,13.97 0 bottom
R3  8.76,14.99 0 bottom
R4  6.86,8.13 90 bottom
R5  5.84,8.13 90 bottom
R6  4.83,8.13 90 bottom
R7  1.02,8.51 90 bottom
R8  11.68,28.07 270 bottom
R9  14.35,31.5 180 bottom
R10  6.99,32.13 90 bottom
R11  6.99,34.42 90 bottom
R12  2.92,6.86 90 bottom
R13  22.99,25.78 0 bottom
R14  26.8,16 270 bottom
R15  14.35,29.72 0 bottom
R16  32.13,33.53 0 bottom
R17  32.13,30.99 0 bottom
R18  27.81,30.1 0 bottom
R19  27.81,30.99 0 bottom
R20  24.64,3.94 180 bottom
RN1  9.02,19.43 90 bottom
RN2  6.1,19.43 270 bottom
U1  5.84,18.41 0 top
U2  3.81,32.51 270 top
U$7  26.04,13.97 180 top
USBVCC  6.6,27.18 180 bottom
Y1  21.46,22.1 270 bottom
Y2  26.67,1.78 180 bottom
Z1  5.97,32.38 90 bottom
Z2  5.97,34.67 90 bottom

### Tracks (layer width: path | path; a pad name or v marks a point on that pad's centre or on a via)
3V3A  (via drill 0.4, 0.5)
  Top 0.203: v18.67,17.78 14.1,17.78
  Top 0.254: v9.65,16.89 9.65,17.4 11.3,19.05 12.83,19.05 14.1,17.78
  Top 0.406: L5.2 27.43,10.92 26.1,12.26 26.1,12.51 C22.A
  Top 0.61: C22.A 25.27,12.95 v24.51,12.19
  Bottom 0.203: C43.1 30.51,11.71 30.35,11.56 | 24.38,12.83 23.88,13.34 23.88,13.36 23.77,13.46 IC4.4
  Bottom 0.254: RN2.6 RN2.5 6.13,17.53 8.51,17.53 9.24,16.79 R1.2 9.24,16.48 v9.65,16.89 | IC4.4 23.75,14.25 23.75,15.11 23.88,15.24 23.88,16.38 23.52,16.74 C40.1 23.21,16.76 19.68,16.76 v18.67,17.78 | C41.1 25.53,15.34 25.78,15.09 IC4.8 | IC4.8 | 27.3,14.19 IC4.11 27.27,13.37 27.81,12.83 | 27.81,12.83 28.07,12.83 28.32,13.08 28.32,13.69 C42.1 | 30.35,11.56 29.5,11.56 IC4.15 28.55,11.53 28.4,11.43 | C44.1 30.88,9.93 30.28,10.54 29.48,10.54 | 29.48,10.54 IC4.17 | C45.1 30.71,8.16 30.35,8.51 29.49,8.51 | 29.49,8.51 IC4.21 | 29.49,8.51 28.45,8.51 27.69,7.75 27.18,7.75 26.04,8.89 26.04,10.67 26.67,11.3 | 24.38,12.83 24.38,12.32 v24.51,12.19 25.27,12.95 C22.A 25.78,13.08 IC4.8 | 29.48,10.54 28.57,10.54 28.4,10.67 28.4,11.43 | 27.56,11.94 27.81,12.19 27.81,12.83 | 27.3,11.68 27.56,11.94 | 27.56,11.94 27.89,11.94 28.4,11.43
  Bottom 0.61: v24.51,12.19 25.78,12.19 26.67,11.3 26.92,11.3 27.3,11.68
3V3D  (via drill 0.5)
  Top 0.254: 27.94,4.45 27.94,4.06 v28.07,3.94
  Top 0.406: 28.95,3.44 IC6.TER | 28.95,3.44 27.94,4.45 27.94,6.99 26.92,8 26.54,8 C23.A 25.65,10.9 L5.1 | 28.95,3.44 IC6.2
  Bottom 0.203: 26.27,4.56 C46.1
  Bottom 0.254: IC4.28 26.27,4.56 | C46.1 v28.07,3.94 28.44,3.94 C19.1
5V  (via drill 0.4, 0.5, 0.8, 0.9)
  Top 0.254: D5.A 6.59,10.54 3.43,10.54 3.17,10.29 3.17,9.27 2.67,8.76 2.29,8.76 2.29,8.89 1.78,9.4 v1.78,10.03 1.02,10.03 0.51,10.54 0.51,13.46 1.38,14.33 U1.P$13
  Top 0.406: C24.1 30.38,5.82 IC6.3
  Top 0.61: J8.2 35.18,8.89 34.16,7.87 30.48,7.87 30.35,7.75 30.35,7.01 C24.1
  Top 0.813: v21.08,34.42 20.57,34.92 20.57,35.69 20.19,36.07 14.86,36.07 13.93,35.14 13.93,34.92 | 13.93,34.92 IC5.P$3 | C29.+ 7.65,35.21 8.64,36.2 12.66,36.2 13.93,34.92
  5V 0.203: IC5.P$3 13.72,34.2 13.72,29.34 v14.35,28.7 14.22,28.57 C11.1 13.07,27.94 v7.62,27.94 7.62,27.56 6.48,26.42
  5V 0.254: U1.P$11 1.76,25.77 2.54,26.54 4.32,26.54 4.45,26.42 6.48,26.42 | v21.08,34.42 21.08,33.27 23.88,30.48 v25.53,30.48 26.54,29.46 31.5,29.46 33.53,27.43 33.53,26.92 31.11,24.51 31.11,22.23 | v21.08,1.52 21.08,1.78 21.72,2.41 29.08,2.41 30.48,3.81 30.48,4.45 34.86,8.83 35.5,8.83 J8.2 29.97,14.48 v29.97,16.26 | v22.73,21.34 22.35,20.95 22.35,19.05 22.1,18.8 22.1,18.16 22.99,17.27 29.23,17.27 29.34,17.17 29.34,16.89 v29.97,16.26 | v32.77,23.62 32.51,23.62 31.11,22.23 | 31.11,22.23 31.11,17.4 v29.97,16.26
  Bottom 0.203: IC3.4 22.08,0.78 | IC2.17 28.32,26.04 28.45,26.26 28.45,26.92 27.8,27.54 C47.1 27.33,29.03 R18.2 | R15.2 13.87,29.24 13.84,29.21 v14.35,28.7 | 29.21,17.4 29.34,17.27 29.34,17.17 C50.1 29.69,16.54 v29.97,16.26 | C49.1 22.89,21.49 v22.73,21.34
  Bottom 0.254: R7.2 1.02,9.27 v1.78,10.03 | U1.P$11 1.76,24.4 2.92,23.24 2.92,21.97 1.78,20.83 1.78,14.35 U1.P$13 | C11.1 13.68,28.55 C13.2 12.54,29.21 IC1.1 12.29,29.36 13.08,28.57 C11.1 | C11.1 | 24.66,21.72 IC2.5 24.91,21.72 24,21.72 23.78,21.49 C49.1 | IC2.38 28.83,18.82 28.83,17.78 29.21,17.4 | IC1.19 9.79,34.63 C14.2 13.29,35.05 IC5.P$3 | C11.1 13.71,29.55 R15.2 | R18.2 R19.2 26.04,30.99 v25.53,30.48 | 22.08,0.78 21.83,0.78 v21.08,1.52 | C48.1 33.22,24.08 v32.77,23.62 32.77,23.11 32.38,22.73 IC2.27
  Bottom 0.61: C30.1 13.93,34.36 IC5.P$3 | USBVCC.2 7.02,27.72 v7.62,27.94
  Bottom 0.813: IC5.P$3 14.73,35.22 D6.2 | L4.2 21.46,35.81 C32.A v21.08,34.42
  other vias: 6.6,36.32 8.64,36.32 9.27,36.32 9.91,36.32 10.54,36.32 11.18,36.32 11.81,36.32
  pour 5V: 0,0 36.83,0 36.83,36.83 0,36.83
A0  (via drill 0.4)
  Top 0.254: J5.5 31.11,31.88 31.11,29.59 30.48,29.08 26.67,29.08 25.91,28.32 25.02,28.32 24.13,27.43 24.13,26.16 26.54,23.75 27.05,23.75 30.1,20.7 30.1,17.78 29.97,17.78 v29.84,17.65
  Bottom 0.203: v29.84,17.65 29.34,18.16 29.34,18.81 IC2.37
A2
  Bottom 0.254: IC2.35 30.32,18.19 30.61,17.91 31.11,17.91 32.51,16.51 J8.8
A3
  Bottom 0.254: J8.9 32.38,17.78 31.37,18.8 30.85,18.8 IC2.34
A4
  Bottom 0.254: IC2.33 31.84,19.73 32.51,19.05 J8.10
ACTLED  (via drill 0.4)
  5V 0.254: v25.4,7.37 26.29,6.48 27.05,6.48 27.43,6.86 27.43,7.37 26.67,8.13 26.42,8.13 20.45,14.1 v18.67,14.1
  Bottom 0.203: R3.1 9.78,14.99 11.56,16.76 12.95,16.76 14.2,15.52 15.7,15.52 17.12,14.1 v18.67,14.1
  Bottom 0.254: IC4.27 26.77,6.25 26.54,6.48 26.29,6.48 v25.4,7.37
CFG  (via drill 0.4)
  GND 0.203: v30.86,28.57 28.45,26.16 28.45,25.91 27.56,25.02 26.67,25.02 24.26,22.61 22.61,22.61 20.45,20.45 20.45,9.53 19.18,8.26 J4.1
  Bottom 0.203: IC2.21 30.32,26.14 30.02,26.44 30.02,26.98 30.86,27.81 v30.86,28.57
  Bottom 0.254: J4.1 17.65,7.37 17.65,6.1 17.14,5.59 17.14,4.83 15.49,3.17 7.62,3.17 4.95,5.84 4.95,6.35 4.92,6.38 R12.1
CFGSW  (via drill 0.4)
  Top 0.254: v3.81,7.62 3.48,6.99 K1.1
  Bottom 0.254: R7.1 C10.2 2.09,7.97 2.29,7.97 R12.2 3.46,7.34 v3.81,7.62
D0_RX
  Bottom 0.203: IC2.9 24.28,23.73 23.75,24.26 23.75,25.02 24.13,25.4 24.13,26.16 23.5,26.8 18.03,26.8 17.27,27.56 17.27,31.24 17.02,31.5 R9.2
D1_TX  (via drill 0.4, 0.5)
  Top 0.254: v11.94,26.67 13.21,26.67 13.97,27.43 v18.29,27.43
  Bottom 0.203: IC2.10 24.42,24.23 24.13,24.51 24.13,24.89 24.51,25.27 24.51,26.42 23.75,27.18 18.67,27.18
  Bottom 0.254: R8.2 11.68,26.92 v11.94,26.67 | v18.29,27.43 18.41,27.43 18.67,27.18
D2  (via drill 0.4)
  Top 0.254: v25.91,27.69 25.15,27.69 24.77,27.3 24.77,26.29 26.67,24.38 27.18,24.38 30.61,20.95 30.61,12.83 33.27,10.16 J8.3
  Bottom 0.203: IC2.11 24.92,26.57 24.51,26.98 24.51,27.05 25.15,27.69 v25.91,27.69
D3  (via drill 0.4)
  Top 0.254: v25.4,26.92 25.53,26.8 25.53,26.29 26.8,25.02 27.3,25.02 31.11,21.21 31.11,13.08 32.77,11.43 J8.4
  Bottom 0.203: IC2.12 25.68,25.62 25.4,25.91 v25.4,26.92
D4  (via drill 0.4)
  Top 0.254: J8.5 32.26,12.7 31.62,13.34 31.62,21.46 27.43,25.65 26.92,25.65 26.42,26.16 26.42,26.54 v26.21,26.75
  Bottom 0.203: 26.29,25.66 26.29,26.67 v26.21,26.75
  Bottom 0.254: 26.29,25.66 IC2.13
D5  (via drill 0.4)
  GND 0.203: v26.8,27.43 26.8,26.54 26.67,26.42 26.67,26.29 26.54,26.16 26.29,26.16 23.88,23.75 22.23,23.75 19.3,20.83 19.3,12.19 19.18,12.06 J13.1
  Bottom 0.203: IC2.14 26.82,26.14 26.72,26.24 26.72,26.47 26.77,26.52 26.77,26.7 26.9,26.82 26.9,27.33 v26.8,27.43
  Bottom 0.254: J13.1 17.14,10.67 17.14,9.65 16.26,8.76 14.99,8.76 13.97,7.75 13.97,5.33 13.34,4.7 8.64,4.7 6.86,6.48 R4.1
D6  (via drill 0.4)
  GND 0.203: v27.3,26.42 26.67,25.78 26.42,25.78 24,23.37 22.35,23.37 19.68,20.7 19.68,11.3 19.18,10.79 J1.1
  Bottom 0.203: IC2.15 27.32,26.4 v27.3,26.42
  Bottom 0.254: J1.1 18.41,10.79 17.65,10.03 17.65,9.4 16.51,8.26 15.24,8.26 14.61,7.62 14.61,5.08 13.72,4.19 8.26,4.19 6.22,6.22 6.22,7.27 R5.1
D7  (via drill 0.4)
  GND 0.203: v26.92,28.32 28.07,27.18 28.07,26.04 27.43,25.4 26.54,25.4 24.13,22.99 22.48,22.99 20.07,20.57 20.07,10.41 19.18,9.53 J3.1
  Bottom 0.203: IC2.16 27.82,26.04 27.94,26.24 27.94,26.67 27.43,27.18 27.43,27.81 v26.92,28.32
  Bottom 0.254: J3.1 17.02,8 17.02,6.35 16.51,5.84 16.51,4.95 15.24,3.68 7.87,3.68 5.46,6.1 5.46,6.73 4.83,7.37 R6.1
D8
  Bottom 0.254: J8.7 30.61,15.24 30.48,15.37 28.96,15.37 28.45,15.88 28.19,15.88 28.07,16 28.07,17.14 27.56,17.65 27.05,17.65 26.8,17.91 26.8,18.8 IC2.42
D9
  Bottom 0.254: IC2.43 26.32,17.62 26.8,17.14 27.3,17.14 27.56,16.89 27.56,15.75 27.94,15.37 28.19,15.37 28.7,14.86 30.35,14.86 31.24,13.97 J8.6
D10  (via drill 0.4)
  GND 0.203: v30.61,26.67 29.72,26.67 27.69,24.64 26.8,24.64 24.38,22.23 22.73,22.23 20.83,20.32 20.83,8.64 19.18,6.99 J6.1
  Bottom 0.203: IC2.22 30.82,26.46 v30.61,26.67
D10_SS  (via drill 0.4)
  Top 0.254: J7.1 22.35,4.19 22.61,4.45 22.61,5.33 22.99,5.71 23.75,5.71 24.13,6.1 v24.13,7.11 24.13,7.62 23.75,8 23.75,8.26 23.5,8.51 22.99,8.51 22.48,9.02 22.48,13.59 23.88,14.99 23.88,17.02 24.26,17.4 24.26,17.65 v24.64,18.03
  Bottom 0.254: IC2.44 24.92,18.82 24.64,18.54 v24.64,18.03 | IC4.32 24.27,6.97 v24.13,7.11
D11
  Bottom 0.254: IC2.23 32.02,25.02 32.26,25.02 32.26,26.04 33.02,26.8 34.29,26.8 35.05,26.04 35.05,25.53 35.18,25.4 J10.1
D11_MOSI  (via drill 0.4)
  Top 0.254: 24.13,19.56 v24.38,19.3 24,19.68 24,19.81 | v21.97,6.73 21.97,6.99 20.95,8 20.95,18.03 22.61,19.68 23.11,19.68 23.24,19.81 24,19.81 | 24,19.81 24,24.77 23.11,25.65 23.11,27.94 24.77,29.59 25.65,29.59 26.42,30.35 29.72,30.35 29.84,30.48 29.84,32.89 v30.35,33.4
  Bottom 0.203: IC4.35 22.77,6.06 22.48,6.35 22.35,6.35 v21.97,6.73
  Bottom 0.254: IC2.1 24.8,19.73 v24.38,19.3 | v30.35,33.4 31.52,33.4 R16.2
D12
  Bottom 0.254: 31.75,24.26 IC2.24 32.35,24.23 32.77,24.64 32.77,25.78 33.27,26.29 34.04,26.29 34.54,25.78 34.54,24.89 34.67,24.77 35.43,24.77 J11.1
D12_MISO  (via drill 0.4)
  Top 0.254: v22.86,6.86 21.46,8.26 21.46,14.86 22.35,15.75 22.35,18.67 22.73,19.05 23.37,19.05 v23.75,18.8 | JP1.1 35.56,31.75 35.56,31.37 35.18,30.99 34.67,30.99 33.91,30.23 32.51,30.23 32.26,29.97 32.26,27.18 v31.88,26.8
  5V 0.254: v23.75,18.8 23.75,19.68 24.51,20.45 24.51,22.61 26.29,24.38 29.97,24.38 31.88,26.16 v31.88,26.8
  Bottom 0.203: v23.75,18.8 23.75,19.68 24.26,20.19 24.89,20.19
  Bottom 0.254: 24.89,20.19 IC2.2 | IC4.34 23.27,6.2 22.86,6.6 v22.86,6.86
D13_SCK  (via drill 0.4)
  Top 0.203: 23.37,17.91 23.88,18.03 24.38,18.67 24.64,18.67 25.02,19.05 25.02,19.56
  Top 0.254: v23.11,7.75 22.73,7.75 21.97,8.51 21.97,13.84 23.37,15.24 23.37,17.91 v22.99,18.41 | 25.02,19.56 25.02,20.07 24.51,20.57 24.51,25.02 23.62,25.91 23.62,27.69 24.89,28.96 25.78,28.96 26.54,29.72 30.35,29.72 30.48,29.84 v30.48,30.1
  Bottom 0.203: IC2.3 24.28,20.73 22.99,19.43 v22.99,18.41
  Bottom 0.254: IC4.33 23.77,6.46 23.5,6.73 23.5,7.37 v23.11,7.75 | v30.48,30.1 30.48,30.35 31.11,30.99 R17.2
GND  (via drill 0.4, 0.7, 0.9)  (1 unrouted)
  Top 0.254: K1.S1 1.06,7.67 0.38,6.99 0.38,1.7 K1.S2 2.46,2.41 K1.2 | C23.C 28.19,8.89 v27.56,9.27 | v26.92,12.57 27.3,12.95 C22.C 29.59,12.95 29.72,12.83 | C21.2 30.48,12.06 29.84,12.7
  Top 0.305: U2.5 3.59,31.24 4.45,31.24 4.7,30.99
  Top 0.406: 30.1,12.45 29.84,12.7 29.72,12.83 v29.72,13.46 | 4.7,30.99 5.28,30.41 C29.- | C24.2 34.92,6.99 J8.1
  Top 0.61: IC6.1 31.87,1.15 32.38,0.64 35.56,0.64 36.2,1.27 36.2,6.99 J8.1
  Top 0.813: C3.2 C2.2 9.92,0.64 10.79,0.64 11.75,1.59 | 11.75,1.59 11.95,1.79 C1.- | v12.06,1.27 11.75,1.59 | K1.2 3.43,2.62 v3.43,4.19 | C29.- 8.32,30.41 9.27,29.46 9.27,26.54 U1.GND1
  GND 0.254: U1.GND2 8.89,13.33 v5.71,16.51 | v22.1,1.52 22.1,3.56 24.77,6.22 24.77,7.87 v24.38,8.26 | v27.18,21.21 26.92,20.95 25.02,20.95 24,19.94 22.61,19.3 21.72,17.91 v21.72,16.13 21.72,8.51 19.56,6.35 19.56,1.52 18.92,0.89 12.45,0.89 v12.06,1.27 | v29.21,16 29.21,13.97 v29.72,13.46
  GND 0.813: U1.GND2 8.89,10.13 J2.2 10.92,7.88 10.92,4.45 11.18,4.19 | 11.18,4.19 12.06,3.3 v12.06,1.27 | v3.43,4.19 3.81,4.57 6.73,4.57 7.11,4.19 11.18,4.19
  Bottom 0.203: 26.16,16 26.16,15.21 26.24,15.14 26.24,14.26 | 30.96,12.67 30.25,12.04 29.5,12.04 | IC2.39 28.32,20.19 28.45,20.32 | v28.57,20.32 28.57,20.83 v28.83,21.08 | C28.1 30.23,0.38 30.1,0.25 23.62,0.25 23.11,0.76 C27.1 | IC2.18 28.82,27.54 C47.2 | IC3.1 20.08,1.41 20.83,2.16 21.34,2.16 21.59,1.91 21.72,1.91 v22.1,1.52 | 28.7,16.66 28.7,16.51 v29.21,16
  Bottom 0.254: 4.42,18.16 C9.1 | v5.71,16.51 5.71,16.74 C8.1 5.08,16.76 4.32,17.53 C9.1 | C14.1 8.41,34.43 IC1.17 8.79,33.7 9.35,33.15 | 9.35,33.15 10.19,33.15 10.21,33.17 | 10.21,33.17 10.21,33.38 10.34,33.5 10.34,34 IC1.20 | IC1.24 12.29,33.7 11.84,33.25 11.84,33.22 11.63,33.02 | 11.63,33.02 12.82,33.02 IC1.26 13.74,33 13.97,32.77 15.49,32.77 15.75,33.02 15.75,33.5 C30.2 | 11.63,33.02 11.56,33.02 | 11.56,33.02 10.36,33.02 10.21,33.17 | 9.35,33.15 9.27,33.07 v9.27,32.89 v9.27,30.61 | 11.56,33.02 11.43,32.89 v11.43,32.77 v11.43,30.73 10.79,30.09 IC1.4 10.79,28.06 U1.GND1 8.77,26.04 5.08,26.04 4.8,26.32 C12.1 3.81,25.81 3.81,20.19 3.43,19.81 3.43,17.65 v3.68,17.4 4.32,18.03 C9.1 | C49.2 23.65,22.45 23.88,22.23 IC2.6 IC2.TGND | C17.1 20.45,25.78 19.94,25.27 19.94,24.64 | 19.94,24.64 19.94,19.05 20.57,18.41 C16.1 | 19.94,24.64 19.43,24.13 | C41.2 R14.1 26.64,16.48 26.16,16 | 26.24,14.26 IC4.9 26.29,14.21 26.29,13.08 26.54,12.83 v26.92,12.57 | C43.2 30.96,12.67 31.11,12.83 | 29.5,12.04 IC4.14 | 29.84,9.53 | IC2.18 28.82,22.73 IC2.TGND | IC2.TGND IC2.28 32.56,22.23 33.2,22.86 U$7.P3 34.29,23.5 34.29,23.93 C48.2 | IC2.TGND IC2.39 28.32,17.65 28.7,17.27 28.7,16.66 C50.2 | C46.2 25.94,4.16 | 31.14,9.27 C45.2 | C27.1 22.13,1.55 v22.1,1.52 | IC4.48 22.75,12.53 23.27,13.05 IC4.3 23.27,15.75 C40.2 22.83,15.78 22.61,16 21.84,16 v21.72,16.13 | C42.2 29.56,13.87 v29.72,13.46 30.35,13.46 30.99,12.83 C43.2 | v27.18,21.21 27.3,21.21 IC2.TGND | 29.84,9.53 30.3,9.53 30.71,9.12 C45.2 | 31.5,9.14 31.62,9.27 31.62,10.41 31.14,10.89 C44.2 30.85,11.03 IC4.16 31.01,11.03 31.11,10.92 31.5,10.92 31.62,11.05 31.62,12.32 31.5,12.45 31.21,12.45 C43.2
  Bottom 0.254: 31.5,9.14 31.02,9.14 C45.2 | 31.5,9.14 31.62,9.02 31.62,8.51 31.75,8.38 31.75,7.39 C24.2 | v24.38,8.26 24.38,7.87 24.77,7.49 24.77,7.11 25.27,6.6 25.4,6.6 25.78,6.22 IC4.29 25.77,4.1 C46.2 | 29.84,9.53 IC4.19 27.81,9.53 v27.56,9.27 | C13.1 12.57,27.18 12.83,26.92 12.83,25.4 12.7,25.27 | C31.2 17.3,33.25 17.78,32.77 20.95,32.77 C32.C | C25.1 C26.1 34.39,34.01 34.54,34.16 34.54,35.81 33.91,36.45 27.56,36.45 26.8,35.69 26.8,33.15 J5.1 | C46.2 26.16,3.71 26.16,3.3 26.29,3.17 29.59,3.17 30.62,4.2 C19.2 30.48,4.32 29.84,4.95 29.84,6 C20.2 30.07,5.97 30.32,5.97 C24.2 | C24.2 34.92,6.99 J8.1
  Bottom 0.406: U1.GND1 10.16,24.89 11.18,24.89 11.56,25.27 12.7,25.27 13.46,25.27 14.23,26.05 15.23,26.05 | 15.23,26.05 16,25.27 16,24.89 16.76,24.13 19.43,24.13 | C11.2 15.51,26.32 15.23,26.05
  Bottom 0.61: L3.2 2.92,26.8 3.43,26.29 4.29,26.29 C12.1 | v26.29,22.73 26.54,22.73 v27.18,22.1 v27.18,21.21 | 27.3,21.21 27.94,21.21 v28.07,21.34 | v28.57,20.32 28.45,20.32 v27.43,20.32 27.43,20.95 v27.18,21.21 | v26.29,21.46 26.92,21.46 v27.18,21.21 | v26.29,20.32 v27.18,21.21 | C30.2 16.47,34.28 IC5.P$2 16.47,34.36 C31.2
  Bottom 0.813: C5.2 35.83,2.66 C4.2 36.2,4.18 36.2,6.35 35.56,6.99 J8.1 | D2.A 3.43,4.94 v3.43,4.19 | J5.1 23.99,32.13 C18.1 23.49,32.64 C32.C
  other vias: 23.37,12.19 23.75,11.68 24.26,11.18 23.11,9.27 23.75,9.14 32.51,5.59 32.89,5.97 33.4,6.22 33.91,6.22 34.42,5.97 34.8,5.71 14.99,2.03 14.99,1.4 14.86,0.89 15.49,1.65 15.88,1.14 12.7,2.41 12.06,2.41 11.43,2.41 11.05,1.91 15.49,34.29 17.4,34.29 16.51,33.27 16.76,32.64 15.88,35.18 17.02,35.18 8.64,28.57 9.27,28.57 9.91,28.57 5.71,30.1 6.35,30.23 6.35,30.86 5.71,30.73
  pour Bottom: 0,0 36.83,0 36.83,36.83 0,36.83
  pour Top: 0,0 36.83,0 36.83,36.83 0,36.83
I2C_SCL
  Bottom 0.203: IC2.19 29.32,26.05 29.21,26.16 29.21,27.69 29.34,27.81 29.34,28.07 28.45,28.96 28.45,29.94 R18.1 28.7,30.1 28.96,30.35 28.96,31.24 29.34,31.62 29.34,33.66 J5.4
I2C_SDA
  Bottom 0.203: IC2.20 29.82,26.08 29.69,26.21 29.69,26.24 29.64,26.34 29.64,27.48 29.72,27.56 29.72,29.84 29.34,30.23 29.34,30.99 29.72,31.37 29.72,34.8 28.83,35.69 27.81,35.69 27.3,35.18 27.3,33.15 J5.3 28.32,31.02 R19.1 28.42,30.86
LINKLED  (via drill 0.4)
  5V 0.254: v26.67,7.11 20.57,13.21 v18.67,13.21
  Bottom 0.203: R2.1 9.4,13.97 11.68,16.26 12.83,16.26 13.97,15.11 15.24,15.11 16.26,14.1 16.26,13.46 16.51,13.21 v18.67,13.21
  Bottom 0.254: v26.67,7.11 26.92,6.86 27.3,6.86 27.81,6.35 27.81,5.37 IC4.25
MOSI
  Bottom 0.254: J5.8 33.4,33.56 C25.2 R16.1
N$1  (via drill 0.4)
  Top 0.254: U1.P$4 11.05,20.32 8.26,17.53 v8.26,16.89
  Bottom 0.254: C8.2 8.13,16.76 v8.26,16.89 8.28,16.86 R1.1
N$2
  Bottom 0.254: C15.2 16.06,30.61 FTDI-RESET.1
N$3  (via drill 0.4)
  Top 0.254: D5.B 7.43,8.26 5.08,8.26 4.83,8.51 v4.83,9.27
  Bottom 0.254: v4.83,9.27 R6.2
N$4  (via drill 0.9)
  Top 0.813: L1.1 8.13,3.06 C3.1 8.11,1.91 6.99,1.91 6.86,1.78 | D1.C 6.11,1.02 6.86,1.78 | v5.46,2.92 5.59,2.92 6.22,2.29 6.35,2.29 6.86,1.78
  Bottom 0.813: D2.C 3.81,1.27 v5.46,2.92
N$5  (via drill 0.4)
  Top 0.254: D5.G 7.43,9.02 6.1,9.02 v5.84,9.27
  Bottom 0.254: v5.84,9.27 R5.2
N$6
  Bottom 0.61: F1.2 2.54,29.72 D4.2 3.56,28.7 4.32,27.94 C12.2
N$7  (via drill 0.6)
  Top 0.406: v1.91,34.42 2.54,33.78 3.53,33.78 U2.1
  Bottom 0.406: F1.1 2.54,35.05 v1.91,34.42
N$8
  Bottom 0.203: Y1.2 21.46,22.61 21.84,22.99 22.99,22.99 23.04,23.04 | 23.04,23.04 23.88,23.04 24.21,22.71 24.9,22.71 IC2.7 | 22.63,25.63 22.86,25.4 22.86,23.22 23.04,23.04
  Bottom 0.254: R13.2 22.63,25.63 | Y1.2 21.46,19.56 21.97,19.05 21.97,18.51 C16.2
N$9
  Bottom 0.254: U1.P$2 C7.2
N$10
  Bottom 0.254: J14.1 J5.6
N$11
  Bottom 0.254: U1.P$1 13.56,24.13 C6.2
N$12
  Bottom 0.203: C17.2 21.69,26.13 21.97,26.42 23.19,26.42 23.32,26.29 23.32,25.93 R13.1 23.37,25.68 23.37,23.62 23.5,23.5 24,23.5 24.27,23.23 IC2.8
  Bottom 0.254: C17.2 21.69,24.48 Y1.1
N$13
  Top 0.813: D1.A 9.12,5.33 J2.1
N$15  (via drill 0.4)
  Top 0.254: D5.R 7.23,7.37 7.87,7.37 8.51,8 v8.51,8.64
  Bottom 0.254: v8.51,8.64 8.48,8.61 R4.2
N$16  (via drill 0.4)
  Top 0.254: U2.3 4.57,32.51 4.95,32.13 v5.21,32
  Bottom 0.254: R10.2 6.63,32.26 6.48,32.26 5.97,31.75 Z1.1 5.6,31.73 v5.21,32
N$17  (via drill 0.4)
  Top 0.254: U2.2 3.58,33.15 4.57,33.15 v5.21,33.78
  Bottom 0.254: v5.21,33.78 5.45,34.02 Z2.1 5.97,34.16 6.35,34.54 6.63,34.54 R11.2
N$18
  Bottom 0.254: IC1.31 13.76,30.5 C15.1
N$19
  Bottom 0.813: L4.1 25.18,35.34 | 25.18,35.34 25.78,34.73 J5.2 | C18.2 24.91,35.34 25.18,35.34
N$20  (via drill 0.4)
  Top 0.254: 27.04,10.02 v26.92,9.91 27.05,10.03 29.97,10.03 30.48,9.53 C21.1
  Bottom 0.254: IC4.20 28.21,9.03 27.81,8.64 27.18,8.64 26.8,9.02 26.8,9.78 v26.92,9.91
N$21  (via drill 0.4)
  Top 0.254: U2.S1 3.73,35.56 5.08,35.56 5.46,35.94 v5.59,35.94 5.59,35.7 Z2.2 5.97,33.15 5.71,32.89 v5.21,32.89
  Top 0.61: U2.S1 3.23,36.07 1.91,36.07 1.57,35.74 U2.S2 0.64,34.54 0.31,34.22 U2.S3 0.76,33.06 0.76,32.13 0.31,31.68 U2.S4 0.31,30.68 0.64,30.35 U2.S5 0.81,29.11 U2.S6
  Bottom 0.254: v5.59,35.94 5.97,35.56 Z2.2 | Z1.2 5.83,32.89 v5.21,32.89
  Bottom 0.406: L3.1 0.91,29.02 U2.S5
N$22
  Bottom 0.254: IC4.22 28.6,8.03 28.32,7.75 28.32,6.76 C20.1
N$23
  Bottom 0.254: R14.2 26.77,15.49 IC4.10
N$24
  Bottom 0.254: IC4.36 J9.1
N$25
  Bottom 0.254: IC2.29 32,21.73 32,21.72 32.89,21.72 33.66,20.95 J12.1
N$67
  Bottom 0.254: R3.2 7.62,14.99 7.11,15.49 4.19,15.49 2.92,14.22 2.92,12.95 U1.P$14
N$321  (via drill 0.4)
  Top 0.254: U1.P$3 13.34,21.59 13.08,21.84 9.91,21.84 9.4,22.35 8,22.35 7.11,21.46 6.48,21.46 5.21,20.19 v4.45,20.19
  Bottom 0.254: 5.06,20.19 v4.45,20.19 4.32,20.07 C9.2 | 5.06,20.19 RN2.7 | 5.06,20.19 5.06,20.27 RN2.8
N$332
  Bottom 0.254: R2.2 7.87,13.97 6.86,14.99 4.45,14.99 3.56,14.1 3.56,11.94 2.29,10.67 1.02,10.67 0.51,11.18 0.51,21.25 U1.P$12
POE_DC_RETURN
  Bottom 0.813: U$7.P2 34.53,4.21 C4.1 34.53,3.41 U$7.P1 34.29,1.91 34.29,1 L2.1 34.54,0.75 C5.1
POE_VIN+
  5V 0.61: U1.P$9 15.88,13.97 16.38,14.48 16.38,20.83 U$7.P6 U$7.P5
  Bottom 0.813: U1.P$9 14.73,11.29 D3.C
POE_VIN-
  5V 0.61: U$7.P8 U$7.P7 15.24,5.08 13.97,6.35 13.97,10.92 U1.P$10
  Bottom 0.813: U1.P$10 12.19,11.55 D3.A
RD+
  Bottom 0.254: IC1.14 7.86,32.5 7.62,32.26 7.62,32.13 7.14,31.65 R10.1
RD-
  Bottom 0.254: IC1.15 7.89,33 7.62,33.27 7.62,33.66 7.49,33.78 7.14,33.78 R11.1
RESET  (via drill 0.4)
  Top 0.254: v2.54,9.65 2.54,10.41 2.92,10.79 2.92,21.34 3.56,21.97 6.86,21.97 8.26,23.37 11.05,23.37 11.68,24 12.7,24 | v20.83,6.35 20.83,6.48 20.45,6.86 20.45,18.29 | 20.45,18.29 22.48,20.32 22.99,20.32 v23.24,20.57 | 12.7,24 13.97,22.73 15.24,22.73 19.68,18.29 20.45,18.29 | 12.7,24 12.7,25.53 14.1,26.92 16.38,26.92 v16.64,26.67 | JP1.2 35.94,34.16 34.54,32.77 34.54,31.62 33.66,30.73 32.26,30.73 31.75,30.23 31.75,27.69 31.5,27.43 31.37,27.43 v31.24,27.3
  5V 0.254: v31.24,27.3 31.24,26.29 30.99,26.04 30.86,26.04 29.72,24.89 26.04,24.89 24,22.86 24,21.34 v23.24,20.57
  Bottom 0.203: 24.91,21.21 24.26,21.21 23.75,20.7 23.37,20.7 v23.24,20.57 | IC3.3 21.66,2.47 21.59,2.54 21.08,2.54 20.83,2.79 20.83,2.92 20.57,3.17 20.57,3.3 20.32,3.56
  Bottom 0.254: C10.1 2.26,8.99 v2.54,9.65 | 24.91,21.21 IC2.4 | 20.32,3.56 20.32,5.84 v20.83,6.35 | R15.1 16.07,29.72 FTDI-RESET.2 16.64,29.52 v16.64,26.67
RXIN
  Bottom 0.203: RN1.6 10.18,19.83 11.68,21.34 12.7,21.34 13.97,20.07 17.53,20.07 18.54,19.05 | IC4.5 24.27,15 24.38,15.11 24.38,16.64 23.62,17.4 22.73,17.4 22.61,17.27 20.29,17.27
  Bottom 0.254: 20.29,17.27 20.29,17.3 18.54,19.05
RXIN_E  (via drill 0.4)
  Top 0.254: v9.14,21.59 9.14,21.23 v7.57,19.86
  Bottom 0.254: RN2.2 v7.57,19.86 RN1.3 | C7.1 9.93,22.38 v9.14,21.59
RXIP
  Bottom 0.203: RN1.5 9.75,20.57 10.29,20.57 11.56,21.84 12.95,21.84 14.22,20.57 17.78,20.57 20.7,17.65 22.35,17.65 22.48,17.78 23.88,17.78 24.89,16.76 24.89,15.11 24.77,14.99 IC4.6
RXIP_E
  Bottom 0.254: C6.1 10.16,24.26 8.38,22.48 8.38,20.67 RN1.4 RN2.1
SCLK
  Bottom 0.254: J5.7 33.43,32.1 C26.2 R17.1
TXON
  Bottom 0.203: RN1.8 11.12,18.23 11.68,18.8 12.7,18.8 13.97,17.53 17.14,17.53 18.67,16 18.67,15.24
  Bottom 0.254: IC4.1 19.52,14.23 19.52,14.26 19.43,14.35 19.43,14.48 18.67,15.24
TXON_E
  Bottom 0.254: RN2.4 RN1.1 8.57,18.23 9.27,17.53 11.94,17.53 U1.P$6
TXOP
  Bottom 0.203: RN1.7 9.71,19.05 11.18,19.05 11.43,19.3 12.83,19.3 14.1,18.03 17.27,18.03 18.8,16.51
  Bottom 0.254: IC4.2 22.77,15.08 22.48,15.37 19.66,15.37 19.66,15.39 19.56,15.49 19.56,15.75 18.8,16.51
TXOP_E  (via drill 0.4)
  Top 0.254: v7.57,19.02 v7.58,19.03 8.49,19.03 10.79,21.34 12.83,21.34 14.48,19.68 14.48,19.3 U1.P$5
  Bottom 0.254: RN2.3 7.75,19.03 | 7.75,19.03 RN1.2 | v7.57,19.02 7.57,18.85 7.75,19.03
USBRXD
  Bottom 0.254: IC1.30 13.22,31 13.46,31.24 13.62,31.24 R9.1
USBTXD
  Bottom 0.254: R8.1 11.56,28.7 11.81,28.96 11.81,29.43 IC1.2
USBVCC
  Bottom 0.61: D4.1 5.97,27.4 USBVCC.1
VIN  (via drill 0.9)
  Top 0.813: C2.1 10.02,2.03 L1.2 10.16,3.32 10.16,3.81 v12.38,6.03 12.94,6.59 C1.+ 15.48,6.59 v15.88,6.99
  5V 0.813: IC5.P$1 19.01,28.24 19.94,27.3 19.94,21.84 17.78,19.94 17.78,13.59 15.88,11.43 v15.88,6.99 | v12.38,6.03 17.78,0.64 30.48,0.64 31.88,2.03 31.88,3.17 v32.64,3.81
  Bottom 0.61: C31.1 19.01,34.28 IC5.P$1
  Bottom 0.813: IC5.P$1 18.16,35.26 D6.1 | L2.2 32.4,1.51 31.88,2.03 31.88,3.17 v32.64,3.81
WIZRST
  Bottom 0.203: IC4.37 19.68,6.14 19.68,2.87 IC3.2
XTLN
  Bottom 0.254: IC4.30 25.27,4.32 25.12,4.16 R20.2 25.12,3.58 26.16,2.54 28.07,2.54 Y2.2 29.56,2.51 C28.2
XTLP
  Bottom 0.203: IC4.31 24.77,4.55 R20.1
  Bottom 0.254: R20.1 24.16,2.77 24.51,2.41 Y2.1 23.78,2.51 C27.2

### Text on the board
_bsilk: 5V | SCL | NA | MOSI | R | GND | SDA | A0 | SKAARDUINO-POE V4 | SKAARHOJ 2016 | GND | DC-IN